# Altium project Thunderscope_Rev5.PrjPCB (part 1 of 2)
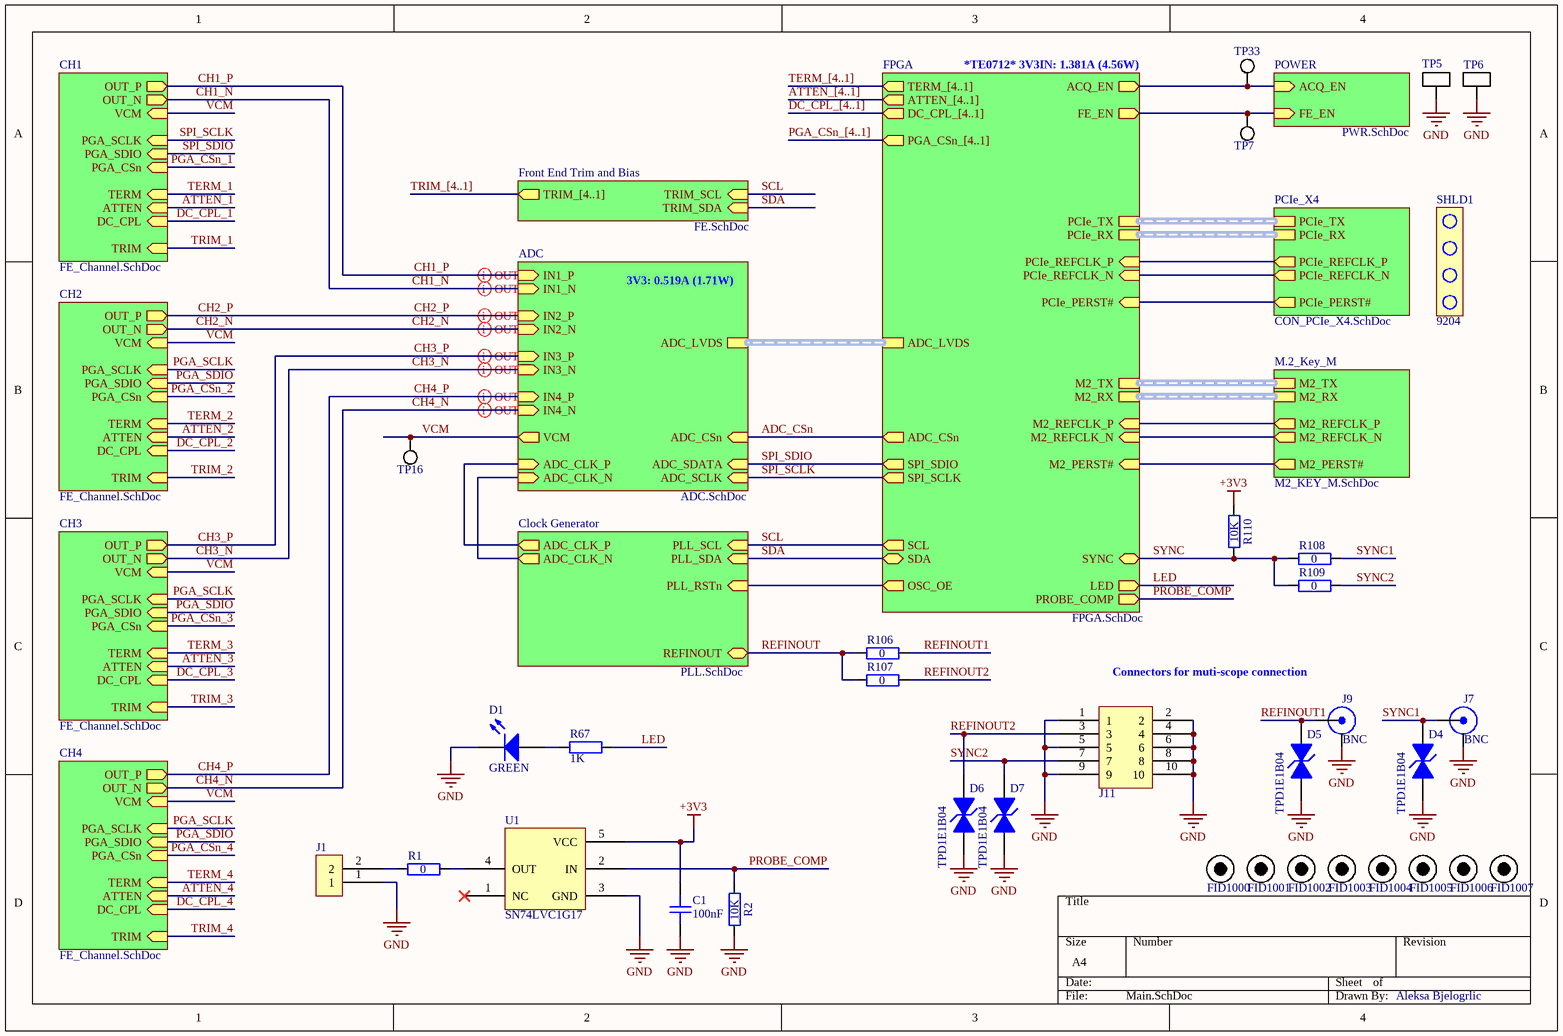
[diagram p0: Main.SchDoc]
Template Notes: - Nominal values used, dimensions in mm  - The mounting holes and keep-out areas around them are only required when the I/O bracket is mounted on the card directly  - Component height rule and clearance rule derived from PCI_Express_CEM_r2.0.pdf, Page 84.  - Stackup is not specified in PCI_Express_CEM_r2.0.pdf, nor implemented in this template.; Template Revision Date: Oct 29, 2010; Template Source Document: Outline:PCI_Express_CEM_r2.0.pdf  Pinout:PCI_Express_CEM_r2.0.pdf; Template Source Organization: PCI-SIG; Template Source Revision Date: R2.0, April 11, 2007; Template Source URL: http://www.pcisig.com; Title: ThunderScope 1000E
14 sheets, 733 parts. Net scope: hierarchical (ports join the sheet entries above them; power ports are global).
Board file: Thunderscope_Rev5.PCBDOC
Sheets:
  Main.SchDoc
    Front End Trim and Bias = FE.SchDoc
    FPGA = FPGA.SchDoc
      FPGA IO Banks = FPGA_Bank_IO.SchDoc
      FPGA Transceivers = FPGA_MGT.SchDoc
      FPGA Configuration = FPGA_CFG.SchDoc
      FPGA Power = FPGA_PWR.SchDoc
      Voltage Regulation = FPGA_REG.SchDoc
    M.2_Key_M = M2_KEY_M.SchDoc
    PCIe_X4 = CON_PCIe_X4.SchDoc
    POWER = PWR.SchDoc
    CH1 = FE_Channel.SchDoc
    ADC = ADC.SchDoc
    Clock Generator = PLL.SchDoc
    CH2 = FE_Channel.SchDoc
    CH3 = FE_Channel.SchDoc
    CH4 = FE_Channel.SchDoc

## Sheet Main.SchDoc: ThunderScope 1000E
size A4; DrawnBy: Aleksa Bjelogrlic; Revision: 1; SheetNumber: 1; SheetTotal: 14

### Parts
C1  100nF  [GEN_C_0402]
D1  GREEN  [LED_0603_LTST-S270K]
D4  TPD1E1B04  [TI_X1SON_DPY0002A]
D5  TPD1E1B04  [TI_X1SON_DPY0002A]
D6  TPD1E1B04  [TI_X1SON_DPY0002A]
D7  TPD1E1B04  [TI_X1SON_DPY0002A]
FID1000  PCB  [GEN_FID]  (value not drawn)  (no BOM)
FID1001  PCB  [GEN_FID]  (value not drawn)  (no BOM)
FID1002  PCB  [GEN_FID]  (value not drawn)  (no BOM)
FID1003  PCB  [GEN_FID]  (value not drawn)  (no BOM)
FID1004  PCB  [GEN_FID]  (value not drawn)  (no BOM)
FID1005  PCB  [GEN_FID]  (value not drawn)  (no BOM)
FID1006  PCB  [GEN_FID]  (value not drawn)  (no BOM)
FID1007  PCB  [GEN_FID]  (value not drawn)  (no BOM)
J1  TSW-101-08-F-D-RA  [GEN_2.54mm_1x2_Pin_TH_RA]  (value not drawn)
J7  BNC  [MOL_0731000105]
J9  BNC  [MOL_0731000105]
J11  1.27mm 6 Pin TH  [GEN_1.27mm_2x5_Pin_TH_RA]  (value not drawn)
R1  0  [GEN_R_0402]
R2  10K  [GEN_R_0402]
R67  1K  [GEN_R_0402]
R106  0  [GEN_R_0402]
R107  0  [GEN_R_0402]
R108  0  [GEN_R_0402]
R109  0  [GEN_R_0402]
R110  10K  [GEN_R_0402]
SHLD1  9204  (mechanical)
TP5  5019  [KEY_5019]  (value not drawn)
TP6  5019  [KEY_5019]  (value not drawn)
TP7  PCB  [GEN_TP_PCB]  (value not drawn)  (no BOM)
TP16  PCB  [GEN_TP_PCB]  (value not drawn)  (no BOM)
TP33  PCB  [GEN_TP_PCB]  (value not drawn)  (no BOM)
U1  SN74LVC1G17  [GEN_SC-70-5]

### Sub-sheets
ADC = ADC.SchDoc: IN4_N (in), IN4_P (in), IN3_N (in), IN3_P (in), IN2_N (in), IN2_P (in), VCM (out), IN1_N (in), IN1_P (in), ADC_CSn (in), ADC_SDATA (in), ADC_SCLK (in), ADC_CLK_P (in), ADC_CLK_N (in), ADC_LVDS (harness ADC LVDS)
CH1 = FE_Channel.SchDoc: OUT_P (out), VCM (in), OUT_N (out), TRIM (in), ATTEN (in), DC_CPL (in), PGA_CSn (in), PGA_SCLK (in), PGA_SDIO (in), TERM (in)
CH2 = FE_Channel.SchDoc: OUT_P (out), VCM (in), OUT_N (out), TRIM (in), ATTEN (in), DC_CPL (in), PGA_CSn (in), PGA_SCLK (in), PGA_SDIO (in), TERM (in)
CH3 = FE_Channel.SchDoc: OUT_P (out), VCM (in), OUT_N (out), TRIM (in), ATTEN (in), DC_CPL (in), PGA_CSn (in), PGA_SCLK (in), PGA_SDIO (in), TERM (in)
CH4 = FE_Channel.SchDoc: OUT_P (out), VCM (in), OUT_N (out), TRIM (in), ATTEN (in), DC_CPL (in), PGA_CSn (in), PGA_SCLK (in), PGA_SDIO (in), TERM (in)
Clock Generator = PLL.SchDoc: ADC_CLK_P (out), ADC_CLK_N (out), PLL_RSTn (in), PLL_SDA (in), PLL_SCL (in), REFINOUT (bidir)
FPGA = FPGA.SchDoc: ACQ_EN (out), OSC_OE (out), ADC_CSn (out), SCL (out), SDA (bidir), FE_EN (out), ATTEN_[4..1] (out), DC_CPL_[4..1] (out), SPI_SCLK (out), SPI_SDIO (out), PGA_CSn_[4..1] (out), PCIe_REFCLK_N (in), PCIe_PERST# (in), PCIe_REFCLK_P (in), PCIe_TX (harness PCIe_X4_TX), PCIe_RX (harness PCIe_X4_RX), M2_REFCLK_N (in), M2_PERST# (in), M2_REFCLK_P (in), M2_TX (harness M2_X4_TX), M2_RX (harness M2_X4_RX), TERM_[4..1] (out), SYNC (bidir), ADC_LVDS (harness ADC LVDS), PROBE_COMP (out), LED (out)
Front End Trim and Bias = FE.SchDoc: TRIM_SCL (in), TRIM_SDA (in), TRIM_[4..1] (out)
M.2_Key_M = M2_KEY_M.SchDoc: M2_REFCLK_N (out), M2_PERST# (out), M2_REFCLK_P (out), M2_TX (harness M2_X4_TX), M2_RX (harness M2_X4_RX)
PCIe_X4 = CON_PCIe_X4.SchDoc: PCIe_REFCLK_N (out), PCIe_PERST# (out), PCIe_REFCLK_P (out), PCIe_TX (harness PCIe_X4_TX), PCIe_RX (harness PCIe_X4_RX)
POWER = PWR.SchDoc: FE_EN (in), ACQ_EN (in)

### Nets
+3V3: C1.1 R110.1 U1.5(VCC)
GND: C1.2 D1.1(K) D4.2(A) D5.2(A) D6.2(A) D7.2(A) J1.1 J7.2(SHIELD) J9.2(SHIELD) J11.1 J11.2 J11.4 J11.5 J11.6 J11.8 J11.9 J11.10 R2.1 TP5.1 TP6.1 U1.3(GND)
ACQ_EN: TP33.1 ; sheet FPGA/ACQ_EN, sheet POWER/ACQ_EN
ADC_CLK_N: sheet ADC/ADC_CLK_N, sheet Clock Generator/ADC_CLK_N
ADC_CLK_P: sheet ADC/ADC_CLK_P, sheet Clock Generator/ADC_CLK_P
ADC_CSn: sheet FPGA/ADC_CSn, sheet ADC/ADC_CSn
CH1_N: sheet CH1/OUT_N, sheet ADC/IN1_N
CH1_P: sheet CH1/OUT_P, sheet ADC/IN1_P
CH2_N: sheet ADC/IN2_N, sheet CH2/OUT_N
CH2_P: sheet ADC/IN2_P, sheet CH2/OUT_P
CH3_N: sheet ADC/IN3_N, sheet CH3/OUT_N
CH3_P: sheet ADC/IN3_P, sheet CH3/OUT_P
CH4_N: sheet ADC/IN4_N, sheet CH4/OUT_N
CH4_P: sheet ADC/IN4_P, sheet CH4/OUT_P
FE_EN: TP7.1 ; sheet FPGA/FE_EN, sheet POWER/FE_EN
LED: R67.2 ; sheet FPGA/LED
M2_PERST#: sheet FPGA/M2_PERST#, sheet M.2_Key_M/M2_PERST#
M2_REFCLK_N: sheet FPGA/M2_REFCLK_N, sheet M.2_Key_M/M2_REFCLK_N
M2_REFCLK_P: sheet FPGA/M2_REFCLK_P, sheet M.2_Key_M/M2_REFCLK_P
OSC_OE: sheet FPGA/OSC_OE, sheet Clock Generator/PLL_RSTn
PCIe_PERST#: sheet FPGA/PCIe_PERST#, sheet PCIe_X4/PCIe_PERST#
PCIe_REFCLK_N: sheet FPGA/PCIe_REFCLK_N, sheet PCIe_X4/PCIe_REFCLK_N
PCIe_REFCLK_P: sheet FPGA/PCIe_REFCLK_P, sheet PCIe_X4/PCIe_REFCLK_P
PGA_SCLK: sheet CH2/PGA_SCLK, sheet CH3/PGA_SCLK, sheet CH4/PGA_SCLK
PGA_SDIO: sheet CH2/PGA_SDIO, sheet CH3/PGA_SDIO, sheet CH4/PGA_SDIO
PROBE_COMP: R2.2 U1.2(IN) ; sheet FPGA/PROBE_COMP
REFINOUT: R106.2 R107.2 ; sheet Clock Generator/REFINOUT
REFINOUT1: D5.1(K) J9.1(Signal) R106.1
REFINOUT2: D6.1(K) J11.3 R107.1
SCL: sheet Front End Trim and Bias/TRIM_SCL, sheet FPGA/SCL, sheet Clock Generator/PLL_SCL
SDA: sheet Front End Trim and Bias/TRIM_SDA, sheet FPGA/SDA, sheet Clock Generator/PLL_SDA
SPI_SCLK: sheet FPGA/SPI_SCLK, sheet CH1/PGA_SCLK, sheet ADC/ADC_SCLK  [project net ADC_SCLK]
SPI_SDIO: sheet FPGA/SPI_SDIO, sheet CH1/PGA_SDIO, sheet ADC/ADC_SDATA  [project net ADC_SDATA]
SYNC: R108.2 R109.2 R110.2 ; sheet FPGA/SYNC
SYNC1: D4.1(K) J7.1(Signal) R108.1
SYNC2: D7.1(K) J11.7 R109.1
VCM: TP16.1 ; sheet CH1/VCM, sheet ADC/VCM, sheet CH2/VCM, sheet CH3/VCM, sheet CH4/VCM
NetD1_2: D1.2(A) R67.1
NetJ1_2: J1.2 R1.1
NetR1_2: R1.2 U1.4(OUT)

Not connected (* = marked no-connect by the designer): U1 1(NC)*

### Buses and harness runs
bus ATTEN_[4..1] = sheet FPGA/ATTEN_[4..1]
bus DC_CPL_[4..1] = sheet FPGA/DC_CPL_[4..1]
bus PGA_CSn_[4..1] = sheet FPGA/PGA_CSn_[4..1]
bus TERM_[4..1] = sheet FPGA/TERM_[4..1]
bus TRIM_[4..1] = sheet Front End Trim and Bias/TRIM_[4..1]
harness sheet ADC/ADC_LVDS = sheet FPGA/ADC_LVDS
harness sheet FPGA/M2_RX = sheet M.2_Key_M/M2_RX
harness sheet FPGA/M2_TX = sheet M.2_Key_M/M2_TX
harness sheet FPGA/PCIe_RX = sheet PCIe_X4/PCIe_RX
harness sheet FPGA/PCIe_TX = sheet PCIe_X4/PCIe_TX

### Layout directives
differential pair; differential pair class 100Z_Diff_PGA: CH1_N, CH1_P, CH2_N, CH2_P, CH3_N, CH3_P, CH4_N, CH4_P

### Notes on the sheet
- *TE0712* 3V3IN: 1.381A (4.56W)
- 3V3: 0.519A (1.71W)
- Connectors for muti-scope connection
- Aleksa Bjelogrlic

### Library data of the parts
C1 = CAP 100nF 16V X7R 0402: House Part Number: C-100nF-0402-002; Manufacturer: Murata; Manufacturer Part Number: GCM155R71C104KA55D; Voltage Rating: 16V; Package: 0402; Supplier 1: Mouser; Supplier Part Number 1: 81-GCM155R71C104KA5D; Value: 100nF
D1 = LED GREEN 0603 LTST-S270K: Manufacturer: Vishay Lite-On; Manufacturer Part Number: LTST-S270KGKT; Supplier 1: Mouser; Supplier Part Number 1: 859-LTST-S270KGKT
D4-D7 = TVS TPD1E1B04: Manufacturer: Texas Instruments; Manufacturer Part Number: TPD1E1B04DPYR; Supplier 1: Texas Instruments; Supplier Part Number 1: TPD1E1B04DPYR
FID1000-FID1007 = FID 1mm: House Part Number: Fiducial-1
J1 = CONN 2.54mm 2 Pin TH RA: Manufacturer: Samtec; Supplier 1: Mouser; Supplier Part Number 1: 200-TSW10108FDRA; Manufacturer Part Number: TSW-101-08-F-D-RA
J7 J9 = BNC JACK R/A: Manufacturer: Molex; Manufacturer Part Number: 73100-0105; Supplier 1: Mouser; Supplier Part Number 1: 538-73100-0105
J11 = CONN 1.27mm 2x5 Pin TH RA: Manufacturer: CNC Tech; Manufacturer Part Number: 3220-10-0200-00; Supplier 1: Digi-Key; Supplier Part Number 1: 1175-1628-ND
R1 R106-R109 = RES 0 OHM 1/16W 0402: Manufacturer: Yageo; Manufacturer Part Number: RC0402JR-070RL; Package: 0402; Supplier 1: Mouser; Supplier Part Number 1: 603-RC0402JR-070RL; Value: 0
R2 R110 = RES 10K OHM 1% 1/10W 0402: Manufacturer: Panasonic; Manufacturer Part Number: ERJ-2RKF1002X; Tolerance: 1%; Package: 0402; Supplier 1: Mouser; Supplier Part Number 1: 667-ERJ-2RKF1002X; Value: 10K
R67 = RES 1K OHM 1% 1/10W 0402: House Part Number: R-1K-0402-1%-001; Manufacturer: Yageo; Manufacturer Part Number: RC0402FR-071KL; Tolerance: 1%; Package: 0402; Supplier 1: Mouser; Supplier Part Number 1: 603-RC0402FR-071KL; Value: 1K
SHLD1 = PCIe IO Shield: Manufacturer: Keystone Electronics; Supplier 1: Mouser; Supplier Part Number 1: 534-9204; Manufacturer Part Number: 9204
TP5 TP6 = TP KEYSTONE 5019: Manufacturer: Keystone Electronics; Supplier 1: Mouser; Supplier Part Number 1: 534-5019; Manufacturer Part Number: 5019
TP7 TP16 TP33 = TP PCB 1mm
U1 = IC BUFFER SN74LVC1G17: Manufacturer: Texas Instruments; Manufacturer Part Number: SN74LVC1G17DBVR; Supplier 1: Texas Instruments; Supplier Part Number 1: SN74LVC1G17DBVR

## Sheet FE.SchDoc: ThunderScope 1000E
size A4; Revision: 1; SheetNumber: 3; SheetTotal: 14
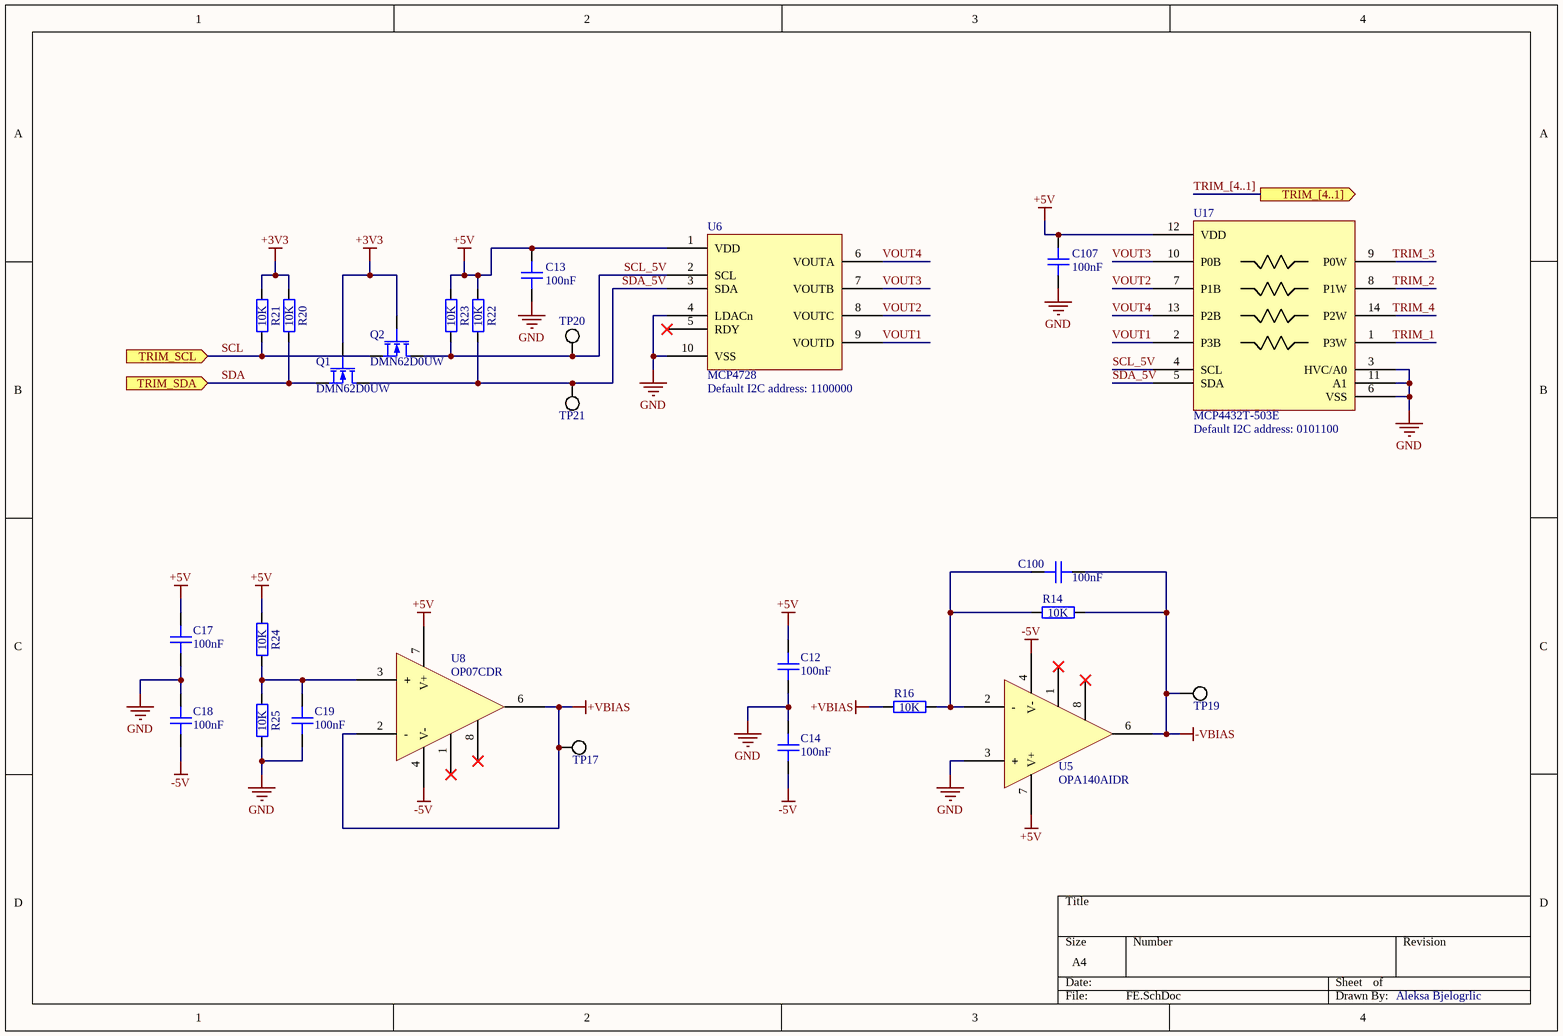
[diagram p1: FE.SchDoc]

### Parts
C12  100nF  [GEN_C_0402]
C13  100nF  [GEN_C_0402]
C14  100nF  [GEN_C_0402]
C17  100nF  [GEN_C_0402]
C18  100nF  [GEN_C_0402]
C19  100nF  [GEN_C_0402]
C100  100nF  [GEN_C_0402]
C107  100nF  [GEN_C_0402]
Q1  DMN62D0UW  [GEN_SOT_323]
Q2  DMN62D0UW  [GEN_SOT_323]
R14  10K  [GEN_R_0402]
R16  10K  [GEN_R_0402]
R20  10K  [GEN_R_0402]
R21  10K  [GEN_R_0402]
R22  10K  [GEN_R_0402]
R23  10K  [GEN_R_0402]
R24  10K  [GEN_R_0402]
R25  10K  [GEN_R_0402]
TP17  PCB  [GEN_TP_PCB]  (value not drawn)  (no BOM)
TP19  PCB  [GEN_TP_PCB]  (value not drawn)  (no BOM)
TP20  PCB  [GEN_TP_PCB]  (value not drawn)  (no BOM)
TP21  PCB  [GEN_TP_PCB]  (value not drawn)  (no BOM)
U5  OPA140AIDR  [TI_SOIC8_D0008A]
U6  MCP4728  [MC_MSOP10_UN]
U8  OP07CDR  [TI_SOIC8_D0008A]
U17  MCP4432T-503E  [MC_TSSOP14]

### Ports
TRIM_[4..1] (out), TRIM_SCL (in), TRIM_SDA (in)

### Nets
+3V3: Q1.2(G) Q2.2(G) R20.2 R21.2
+5V: C12.1 C13.2 C17.1 C107.2 R22.2 R23.2 R24.2 U5.7(V+) U6.1(VDD) U8.7(V+) U17.12(VDD)
+VBIAS: R16.1 TP17.1 U8.2(-) U8.6(OUT)
-5V: C14.2 C18.2 U5.4(V-) U8.4(V-)
-VBIAS: C100.1 R14.2 TP19.1 U5.6(OUT)
GND: C12.2 C13.1 C14.1 C17.2 C18.1 C19.1 C107.1 R25.1 U5.3(+) U6.4(LDACn) U6.10(VSS) U17.3(HVC/A0) U17.6(VSS) U17.11(A1)
SCL: Q2.3(S) R21.1 ; port TRIM_SCL
SCL_5V: Q2.1(D) R23.1 TP20.1 U6.2(SCL) U17.4(SCL)
SDA: Q1.3(S) R20.1 ; port TRIM_SDA
SDA_5V: Q1.1(D) R22.1 TP21.1 U6.3(SDA) U17.5(SDA)
TRIM_1: U17.1(P3W)
TRIM_2: U17.8(P1W)
TRIM_3: U17.9(P0W)
TRIM_4: U17.14(P2W)
VOUT1: U6.9(VOUTD) U17.2(P3B)
VOUT2: U6.8(VOUTC) U17.7(P1B)
VOUT3: U6.7(VOUTB) U17.10(P0B)
VOUT4: U6.6(VOUTA) U17.13(P2B)
NetC19_2: C19.2 R24.1 R25.2 U8.3(+)
NetC100_2: C100.2 R14.1 R16.2 U5.2(-)

Not connected (* = marked no-connect by the designer): U5 1(N1)* 8(N2)*; U6 5(RDY)*; U8 1(N1)* 8(N2)*

### Buses and harness runs
bus TRIM_[4..1] = port TRIM_[4..1]

### Notes on the sheet
- (near U6) Default I2C address: 1100000
- (near U17) Default I2C address: 0101100
- Aleksa Bjelogrlic

### Library data of the parts
C12-C14 C17-C19 C100 C107 = CAP 100nF 16V X7R 0402: as C1 on sheet Main; Package: 0402; Supplier 1: Mouser; Supplier Part Number 1: 81-GCM155R71C104KA5D; Value: 100nF
Q1 Q2 = NMOS DMN62D0UW: House Part Number: DMN62D0UW-7; Manufacturer: Diodes; Vdss: 60V; Supplier 1: Mouser; Supplier Part Number 1: 621-DMN62D0UW-7; Manufacturer Part Number: DMN62D0UW-7
R14 R16 R20-R25 = RES 10K OHM 1% 1/10W 0402: as R2 on sheet Main; Package: 0402; Supplier 1: Mouser; Supplier Part Number 1: 667-ERJ-2RKF1002X; Value: 10K
TP17 TP19-TP21 = TP PCB 1mm
U5 = IC OPAMP OPA140: Manufacturer: Texas Instruments; Supplier 1: Texas Instruments; Supplier Part Number 1: OPA140AIDR; Manufacturer Part Number: OPA140AIDR
U6 = IC DAC QUAD MCP4728: Manufacturer: Microchip; Supplier 1: Mouser; Supplier Part Number 1: 579-MCP4728A1T-E/UN; Manufacturer Part Number: MCP4728
U8 = IC OPAMP OP07CDR: Manufacturer: Texas Instruments; Supplier 1: Texas Instruments; Supplier Part Number 1: OP07CDR; Manufacturer Part Number: OP07CDR
U17 = IC DIGIPOT QUAD MCP4432T-503E: Manufacturer: Microchip; Manufacturer Part Number: MCP4432T-503E/ST; Supplier 1: Mouser; Supplier Part Number 1: 579-MCP4432-503E/ST

## Sheet FPGA.SchDoc: ThunderScope 1000E
size A4; SheetNumber: 7; SheetTotal: 14
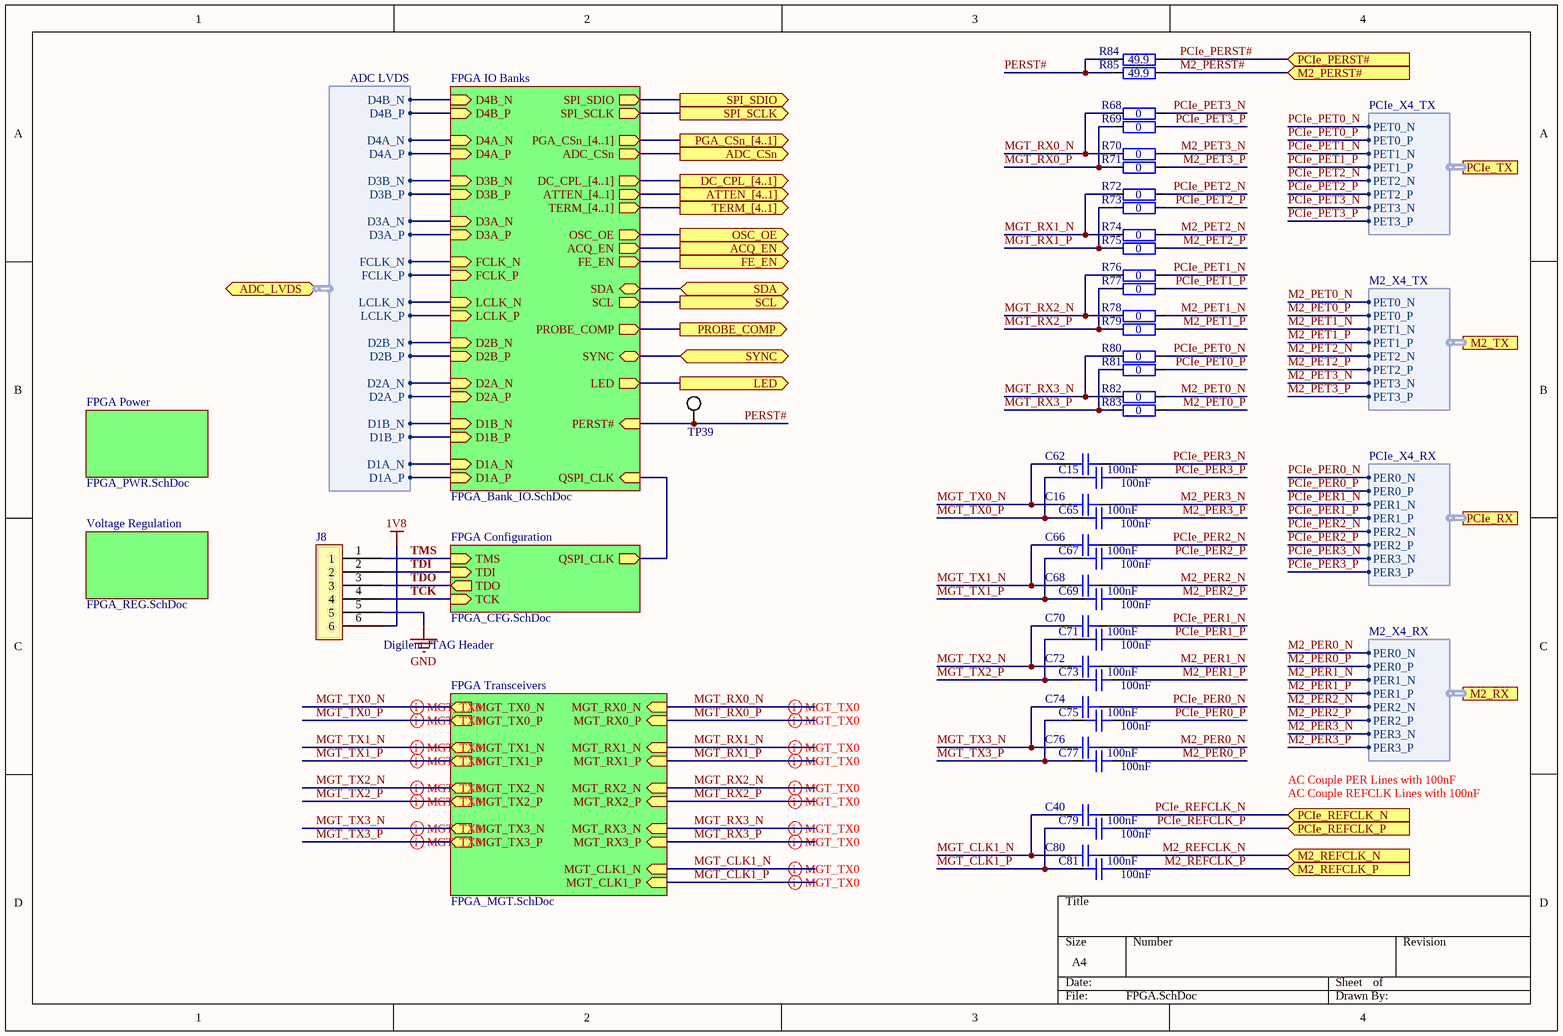
[diagram p2: FPGA.SchDoc]

### Parts
C15  100nF  [GEN_C_0201]
C16  100nF  [GEN_C_0201]
C40  100nF  [GEN_C_0201]
C62  100nF  [GEN_C_0201]
C65  100nF  [GEN_C_0201]
C66  100nF  [GEN_C_0201]
C67  100nF  [GEN_C_0201]
C68  100nF  [GEN_C_0201]
C69  100nF  [GEN_C_0201]
C70  100nF  [GEN_C_0201]
C71  100nF  [GEN_C_0201]
C72  100nF  [GEN_C_0201]
C73  100nF  [GEN_C_0201]
C74  100nF  [GEN_C_0201]
C75  100nF  [GEN_C_0201]
C76  100nF  [GEN_C_0201]
C77  100nF  [GEN_C_0201]
C79  100nF  [GEN_C_0201]
C80  100nF  [GEN_C_0201]
C81  100nF  [GEN_C_0201]
J8  2.54mm 6 Pin TH  [GEN_2.54mm_6_Pin_TH_RA]  (value not drawn)
R68  0  [GEN_R_0201]
R69  0  [GEN_R_0201]
R70  0  [GEN_R_0201]
R71  0  [GEN_R_0201]
R72  0  [GEN_R_0201]
R73  0  [GEN_R_0201]
R74  0  [GEN_R_0201]
R75  0  [GEN_R_0201]
R76  0  [GEN_R_0201]
R77  0  [GEN_R_0201]
R78  0  [GEN_R_0201]
R79  0  [GEN_R_0201]
R80  0  [GEN_R_0201]
R81  0  [GEN_R_0201]
R82  0  [GEN_R_0201]
R83  0  [GEN_R_0201]
R84  49.9  [GEN_R_0402]
R85  49.9  [GEN_R_0402]
TP39  PCB  [GEN_TP_PCB]  (value not drawn)  (no BOM)

### Sub-sheets
FPGA Configuration = FPGA_CFG.SchDoc: TDI (in), TDO (out), TCK (in), TMS (in), QSPI_CLK (out)
FPGA IO Banks = FPGA_Bank_IO.SchDoc: LCLK_P (in), LCLK_N (in), FCLK_P (in), FCLK_N (in), D1B_P (in), D1B_N (in), D3B_N (in), D3B_P (in), D1A_P (in), D1A_N (in), D4A_N (in), D4A_P (in), D3A_P (in), D3A_N (in), D4B_N (in), D4B_P (in), D2A_N (in), D2A_P (in), D2B_N (in), D2B_P (in), SPI_SDIO (out), SYNC (bidir), SPI_SCLK (out), PROBE_COMP (out), OSC_OE (out), ACQ_EN (out), FE_EN (out), SDA (bidir), SCL (out), ADC_CSn (out), PERST# (in), DC_CPL_[4..1] (out), ATTEN_[4..1] (out), PGA_CSn_[4..1] (out), TERM_[4..1] (out), LED (out), QSPI_CLK (in)
FPGA Power = FPGA_PWR.SchDoc: no entries
FPGA Transceivers = FPGA_MGT.SchDoc: MGT_TX3_N (out), MGT_TX2_N (out), MGT_TX1_N (out), MGT_TX0_N (out), MGT_TX3_P (out), MGT_TX2_P (out), MGT_TX1_P (out), MGT_TX0_P (out), MGT_RX3_N (in), MGT_RX3_P (in), MGT_RX2_N (in), MGT_RX2_P (in), MGT_RX1_N (in), MGT_RX1_P (in), MGT_RX0_N (in), MGT_RX0_P (in), MGT_CLK1_N (in), MGT_CLK1_P (in)
Voltage Regulation = FPGA_REG.SchDoc: no entries

### Ports
ACQ_EN (out), ADC_CSn (out), ADC_LVDS (bidir, harness ADC LVDS), ATTEN_[4..1] (out), DC_CPL_[4..1] (out), FE_EN (out), LED (out), M2_PERST# (in), M2_REFCLK_N (in), M2_REFCLK_P (in), M2_RX (harness M2_X4_RX), M2_TX (harness M2_X4_TX), OSC_OE (out), PCIe_PERST# (in), PCIe_REFCLK_N (in), PCIe_REFCLK_P (in), PCIe_RX (harness PCIe_X4_RX), PCIe_TX (harness PCIe_X4_TX), PGA_CSn_[4..1] (out), PROBE_COMP (out), SCL (out), SDA (bidir), SPI_SCLK (out), SPI_SDIO (out), SYNC (bidir), TERM_[4..1] (out)

### Harnesses
PCIe_X4_RX: PER0_N, PER0_P, PER1_N, PER1_P, PER2_N, PER2_P, PER3_N, PER3_P
PCIe_X4_TX: PET0_N, PET0_P, PET1_N, PET1_P, PET2_N, PET2_P, PET3_N, PET3_P
M2_X4_RX: PER0_N, PER0_P, PER1_N, PER1_P, PER2_N, PER2_P, PER3_N, PER3_P
M2_X4_TX: PET0_N, PET0_P, PET1_N, PET1_P, PET2_N, PET2_P, PET3_N, PET3_P
ADC LVDS: D4B_N, D4B_P, D4A_N, D4A_P, D3B_N, D3B_P, D3A_N, D3A_P, FCLK_N, FCLK_P, LCLK_N, LCLK_P, D2B_N, D2B_P, D2A_N, D2A_P, D1B_N, D1B_P, D1A_N, D1A_P

### Nets
1V8: J8.6
GND: J8.5
ACQ_EN: port ACQ_EN, sheet FPGA IO Banks/ACQ_EN
ADC_CSn: port ADC_CSn, sheet FPGA IO Banks/ADC_CSn
ADC_SCLK: port SPI_SCLK, sheet FPGA IO Banks/SPI_SCLK
ADC_SDATA: port SPI_SDIO, sheet FPGA IO Banks/SPI_SDIO
D1A_N: sheet FPGA IO Banks/D1A_N, port ADC_LVDS.D1A_N
D1A_P: sheet FPGA IO Banks/D1A_P, port ADC_LVDS.D1A_P
D1B_N: sheet FPGA IO Banks/D1B_N, port ADC_LVDS.D1B_N
D1B_P: sheet FPGA IO Banks/D1B_P, port ADC_LVDS.D1B_P
D2A_N: sheet FPGA IO Banks/D2A_N, port ADC_LVDS.D2A_N
D2A_P: sheet FPGA IO Banks/D2A_P, port ADC_LVDS.D2A_P
D2B_N: sheet FPGA IO Banks/D2B_N, port ADC_LVDS.D2B_N
D2B_P: sheet FPGA IO Banks/D2B_P, port ADC_LVDS.D2B_P
D3A_N: sheet FPGA IO Banks/D3A_N, port ADC_LVDS.D3A_N
D3A_P: sheet FPGA IO Banks/D3A_P, port ADC_LVDS.D3A_P
D3B_N: sheet FPGA IO Banks/D3B_N, port ADC_LVDS.D3B_N
D3B_P: sheet FPGA IO Banks/D3B_P, port ADC_LVDS.D3B_P
D4A_N: sheet FPGA IO Banks/D4A_N, port ADC_LVDS.D4A_N
D4A_P: sheet FPGA IO Banks/D4A_P, port ADC_LVDS.D4A_P
D4B_N: sheet FPGA IO Banks/D4B_N, port ADC_LVDS.D4B_N
D4B_P: sheet FPGA IO Banks/D4B_P, port ADC_LVDS.D4B_P
FCLK_N: sheet FPGA IO Banks/FCLK_N, port ADC_LVDS.FCLK_N
FCLK_P: sheet FPGA IO Banks/FCLK_P, port ADC_LVDS.FCLK_P
FE_EN: port FE_EN, sheet FPGA IO Banks/FE_EN
LCLK_N: sheet FPGA IO Banks/LCLK_N, port ADC_LVDS.LCLK_N
LCLK_P: sheet FPGA IO Banks/LCLK_P, port ADC_LVDS.LCLK_P
LED: port LED, sheet FPGA IO Banks/LED
M2_PER0_N: C76.1 ; port M2_RX.PER0_N
M2_PER0_P: C77.1 ; port M2_RX.PER0_P
M2_PER1_N: C72.1 ; port M2_RX.PER1_N
M2_PER1_P: C73.1 ; port M2_RX.PER1_P
M2_PER2_N: C68.1 ; port M2_RX.PER2_N
M2_PER2_P: C69.1 ; port M2_RX.PER2_P
M2_PER3_N: C16.1 ; port M2_RX.PER3_N
M2_PER3_P: C65.1 ; port M2_RX.PER3_P
M2_PERST#: R85.2 ; port M2_PERST#
M2_PET0_N: R82.2 ; port M2_TX.PET0_N
M2_PET0_P: R83.2 ; port M2_TX.PET0_P
M2_PET1_N: R78.2 ; port M2_TX.PET1_N
M2_PET1_P: R79.2 ; port M2_TX.PET1_P
M2_PET2_N: R74.2 ; port M2_TX.PET2_N
M2_PET2_P: R75.2 ; port M2_TX.PET2_P
M2_PET3_N: R70.2 ; port M2_TX.PET3_N
M2_PET3_P: R71.2 ; port M2_TX.PET3_P
M2_REFCLK_N: C80.1 ; port M2_REFCLK_N
M2_REFCLK_P: C81.1 ; port M2_REFCLK_P
MGT_CLK1_N: C40.2 C80.2 ; sheet FPGA Transceivers/MGT_CLK1_N
MGT_CLK1_P: C79.2 C81.2 ; sheet FPGA Transceivers/MGT_CLK1_P
MGT_RX0_N: R68.1 R70.1 ; sheet FPGA Transceivers/MGT_RX0_N
MGT_RX0_P: R69.1 R71.1 ; sheet FPGA Transceivers/MGT_RX0_P
MGT_RX1_N: R72.1 R74.1 ; sheet FPGA Transceivers/MGT_RX1_N
MGT_RX1_P: R73.1 R75.1 ; sheet FPGA Transceivers/MGT_RX1_P
MGT_RX2_N: R76.1 R78.1 ; sheet FPGA Transceivers/MGT_RX2_N
MGT_RX2_P: R77.1 R79.1 ; sheet FPGA Transceivers/MGT_RX2_P
MGT_RX3_N: R80.1 R82.1 ; sheet FPGA Transceivers/MGT_RX3_N
MGT_RX3_P: R81.1 R83.1 ; sheet FPGA Transceivers/MGT_RX3_P
MGT_TX0_N: C16.2 C62.2 ; sheet FPGA Transceivers/MGT_TX0_N
MGT_TX0_P: C15.2 C65.2 ; sheet FPGA Transceivers/MGT_TX0_P
MGT_TX1_N: C66.2 C68.2 ; sheet FPGA Transceivers/MGT_TX1_N
MGT_TX1_P: C67.2 C69.2 ; sheet FPGA Transceivers/MGT_TX1_P
MGT_TX2_N: C70.2 C72.2 ; sheet FPGA Transceivers/MGT_TX2_N
MGT_TX2_P: C71.2 C73.2 ; sheet FPGA Transceivers/MGT_TX2_P
MGT_TX3_N: C74.2 C76.2 ; sheet FPGA Transceivers/MGT_TX3_N
MGT_TX3_P: C75.2 C77.2 ; sheet FPGA Transceivers/MGT_TX3_P
OSC_OE: port OSC_OE, sheet FPGA IO Banks/OSC_OE
PCIe_PER0_N: C74.1 ; port PCIe_RX.PER0_N
PCIe_PER0_P: C75.1 ; port PCIe_RX.PER0_P
PCIe_PER1_N: C70.1 ; port PCIe_RX.PER1_N
PCIe_PER1_P: C71.1 ; port PCIe_RX.PER1_P
PCIe_PER2_N: C66.1 ; port PCIe_RX.PER2_N
PCIe_PER2_P: C67.1 ; port PCIe_RX.PER2_P
PCIe_PER3_N: C62.1 ; port PCIe_RX.PER3_N
PCIe_PER3_P: C15.1 ; port PCIe_RX.PER3_P
PCIe_PERST#: R84.2 ; port PCIe_PERST#
PCIe_PET0_N: R80.2 ; port PCIe_TX.PET0_N
PCIe_PET0_P: R81.2 ; port PCIe_TX.PET0_P
PCIe_PET1_N: R76.2 ; port PCIe_TX.PET1_N
PCIe_PET1_P: R77.2 ; port PCIe_TX.PET1_P
PCIe_PET2_N: R72.2 ; port PCIe_TX.PET2_N
PCIe_PET2_P: R73.2 ; port PCIe_TX.PET2_P
PCIe_PET3_N: R68.2 ; port PCIe_TX.PET3_N
PCIe_PET3_P: R69.2 ; port PCIe_TX.PET3_P
PCIe_REFCLK_N: C40.1 ; port PCIe_REFCLK_N
PCIe_REFCLK_P: C79.1 ; port PCIe_REFCLK_P
PERST#: R84.1 R85.1 TP39.1 ; sheet FPGA IO Banks/PERST#
PROBE_COMP: port PROBE_COMP, sheet FPGA IO Banks/PROBE_COMP
QSPI_CLK: sheet FPGA IO Banks/QSPI_CLK, sheet FPGA Configuration/QSPI_CLK
SCL: port SCL, sheet FPGA IO Banks/SCL
SDA: port SDA, sheet FPGA IO Banks/SDA
SYNC: port SYNC, sheet FPGA IO Banks/SYNC
TCK: J8.4 ; sheet FPGA Configuration/TCK
TDI: J8.2 ; sheet FPGA Configuration/TDI
TDO: J8.3 ; sheet FPGA Configuration/TDO
TMS: J8.1 ; sheet FPGA Configuration/TMS

### Buses and harness runs
bus port ATTEN_[4..1] = sheet FPGA IO Banks/ATTEN_[4..1]
bus port DC_CPL_[4..1] = sheet FPGA IO Banks/DC_CPL_[4..1]
bus port PGA_CSn_[4..1] = sheet FPGA IO Banks/PGA_CSn_[4..1]
bus port TERM_[4..1] = sheet FPGA IO Banks/TERM_[4..1]

### Layout directives
differential pair; differential pair class PCIe: MGT_CLK1_N, MGT_CLK1_P, MGT_RX0_N, MGT_RX0_P, MGT_RX1_N, MGT_RX1_P, MGT_RX2_N, MGT_RX2_P, MGT_RX3_N, MGT_RX3_P, MGT_TX0_N, MGT_TX0_P, MGT_TX1_N, MGT_TX1_P, MGT_TX2_N, MGT_TX2_P, MGT_TX3_N, MGT_TX3_P

### Notes on the sheet
- (near J8) Digilent JTAG Header
- AC Couple PER Lines with 100nF
- AC Couple REFCLK Lines with 100nF

### Library data of the parts
C15 C16 C40 C62 C65-C77 C79-C81 = CAP 100nF 6.3V X5R 0201: House Part Number: C-100nF-0201-002; Manufacturer: Murata; Manufacturer Part Number: GRM033R60J104KE19D; Voltage Rating: 6.3V; Package: 0201; Supplier 1: Mouser; Supplier Part Number 1: 81-GRM033R60J104KE19; Value: 100nF
J8 = CONN 2.54mm 6 Pin TH RA: Manufacturer: Wurth Electronics; Manufacturer Part Number: 61300611021; Supplier 1: Mouser; Supplier Part Number 1: 710-61300611021
R68-R83 = RES 0 OHM 1% 1/20W 0201: Manufacturer: Stackpole Electronics; Manufacturer Part Number: RMCF0201ZT0R00; Tolerance: 1%; Package: 0201; Supplier 1: Mouser; Supplier Part Number 1: 708-RMCF0201ZT0R00; Value: 0
R84 R85 = RES 49.9 OHM 1% 1/10W 0402: Manufacturer: Yageo; Manufacturer Part Number: RC0402FR-0749R9L; Tolerance: 1%; Package: 0402; Supplier 1: Mouser; Supplier Part Number 1: 603-RC0402FR-0749R9L; Value: 49.9
TP39 = TP PCB 1mm

## Sheet FPGA_Bank_IO.SchDoc: ThunderScope 1000E
size A4; SheetNumber: 8; SheetTotal: 14
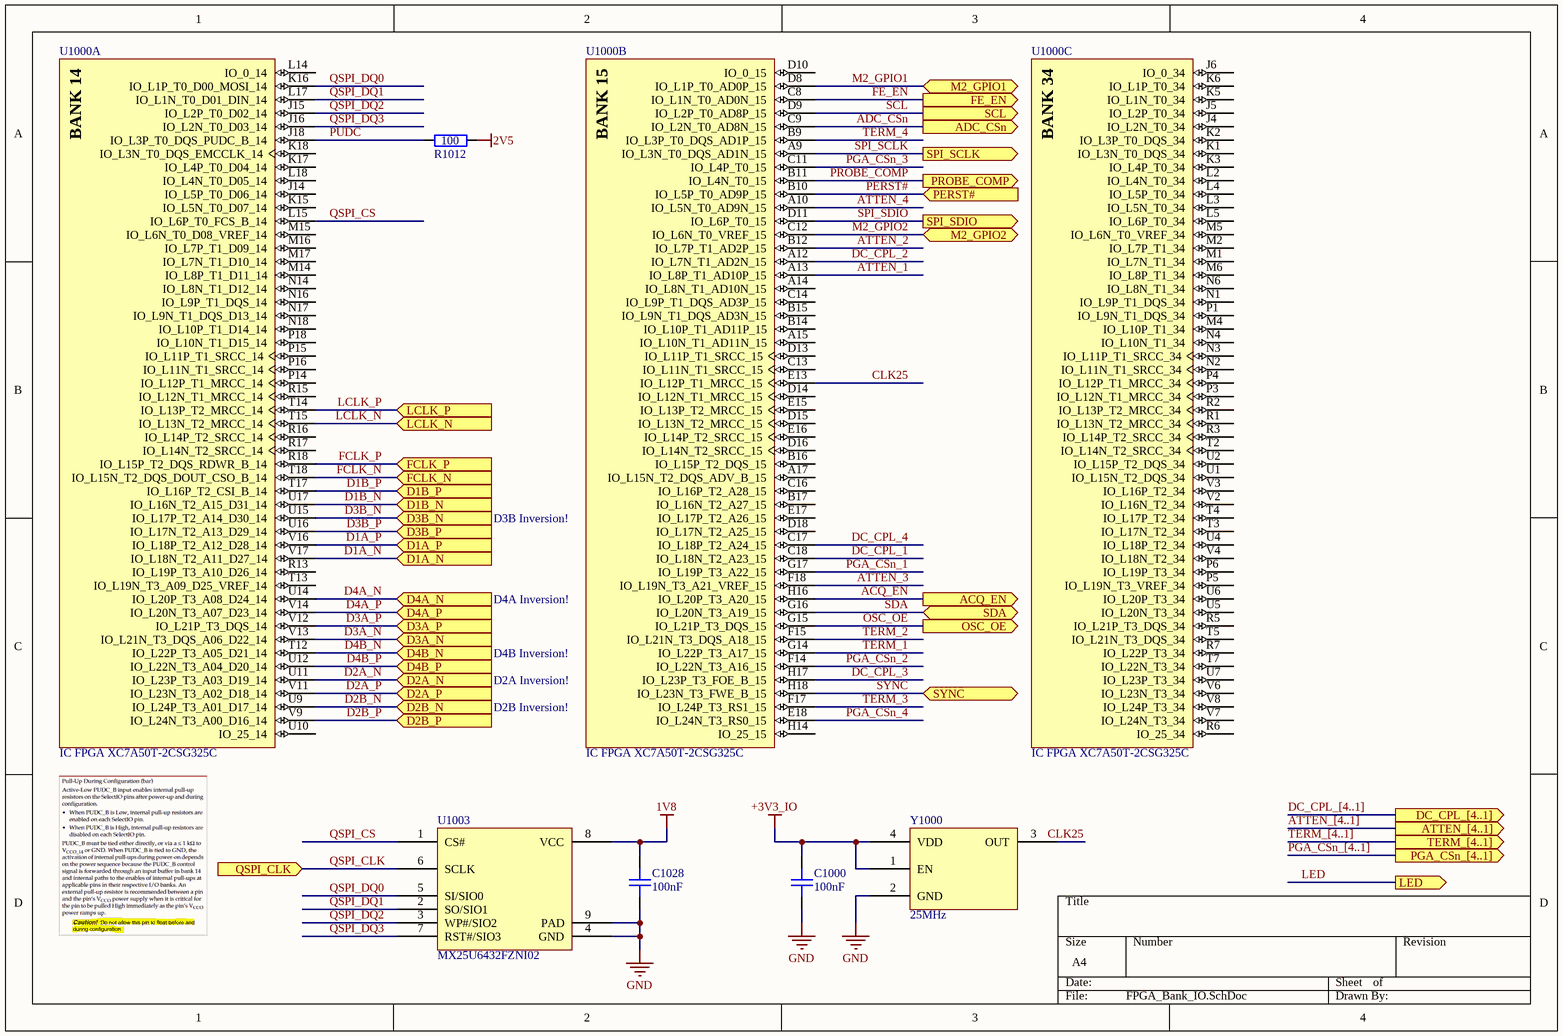
[diagram p3: FPGA_Bank_IO.SchDoc]

### Parts
C1000  100nF  [GEN_C_0402]
C1028  100nF  [GEN_C_0402]
R1012  100  [GEN_R_0402]
U1000  IC FPGA XC7A50T-2CSG325C  [XILINX_XC7A50T-2CSG325C]  (parts A,B,C of 9)
U1003  MX25U6432FZNI02  [MX_WSON8]
Y1000  25MHz  [ECS_TXO-2016]

### Ports
ACQ_EN (out), ADC_CSn (out), ATTEN_[4..1] (out), D1A_N (in), D1A_P (in), D1B_N (in), D1B_P (in), D2A_N (in), D2A_P (in), D2B_N (in), D2B_P (in), D3A_N (in), D3A_P (in), D3B_N (in), D3B_P (in), D4A_N (in), D4A_P (in), D4B_N (in), D4B_P (in), DC_CPL_[4..1] (out), FCLK_N (in), FCLK_P (in), FE_EN (out), LCLK_N (in), LCLK_P (in), LED (out), M2_GPIO1 (bidir), M2_GPIO2 (bidir), OSC_OE (out), PERST# (in), PGA_CSn_[4..1] (out), PROBE_COMP (out), QSPI_CLK (in), SCL (out), SDA (bidir), SPI_SCLK (out), SPI_SDIO (out), SYNC (bidir), TERM_[4..1] (out)

### Nets
1V8: C1028.1 U1003.8(VCC)
2V5: R1012.2
+3V3_IO: C1000.1 Y1000.1(EN) Y1000.4(VDD)
GND: C1000.2 C1028.2 U1003.4(GND) U1003.9(PAD) Y1000.2(GND)
ACQ_EN: U1000.H16(IO_L20P_T3_A20_15) ; port ACQ_EN
ADC_CSn: U1000.C9(IO_L2N_T0_AD8N_15) ; port ADC_CSn
ATTEN_1: U1000.A13(IO_L8P_T1_AD10P_15)
ATTEN_2: U1000.B12(IO_L7P_T1_AD2P_15)
ATTEN_3: U1000.F18(IO_L19N_T3_A21_VREF_15)
ATTEN_4: U1000.A10(IO_L5N_T0_AD9N_15)
CLK25: U1000.E13(IO_L12P_T1_MRCC_15) Y1000.3(OUT)
D1A_N: U1000.V17(IO_L18N_T2_A11_D27_14) ; port D1A_N
D1A_P: U1000.V16(IO_L18P_T2_A12_D28_14) ; port D1A_P
D1B_N: U1000.U17(IO_L16N_T2_A15_D31_14) ; port D1B_N
D1B_P: U1000.T17(IO_L16P_T2_CSI_B_14) ; port D1B_P
D2A_N: U1000.U11(IO_L23P_T3_A03_D19_14) ; port D2A_N
D2A_P: U1000.V11(IO_L23N_T3_A02_D18_14) ; port D2A_P
D2B_N: U1000.U9(IO_L24P_T3_A01_D17_14) ; port D2B_N
D2B_P: U1000.V9(IO_L24N_T3_A00_D16_14) ; port D2B_P
D3A_N: U1000.V13(IO_L21N_T3_DQS_A06_D22_14) ; port D3A_N
D3A_P: U1000.V12(IO_L21P_T3_DQS_14) ; port D3A_P
D3B_N: U1000.U15(IO_L17P_T2_A14_D30_14) ; port D3B_N
D3B_P: U1000.U16(IO_L17N_T2_A13_D29_14) ; port D3B_P
D4A_N: U1000.U14(IO_L20P_T3_A08_D24_14) ; port D4A_N
D4A_P: U1000.V14(IO_L20N_T3_A07_D23_14) ; port D4A_P
D4B_N: U1000.T12(IO_L22P_T3_A05_D21_14) ; port D4B_N
D4B_P: U1000.U12(IO_L22N_T3_A04_D20_14) ; port D4B_P
DC_CPL_1: U1000.C18(IO_L18N_T2_A23_15)
DC_CPL_2: U1000.A12(IO_L7N_T1_AD2N_15)
DC_CPL_3: U1000.H17(IO_L23P_T3_FOE_B_15)
DC_CPL_4: U1000.C17(IO_L18P_T2_A24_15)
FCLK_N: U1000.T18(IO_L15N_T2_DQS_DOUT_CSO_B_14) ; port FCLK_N
FCLK_P: U1000.R18(IO_L15P_T2_DQS_RDWR_B_14) ; port FCLK_P
FE_EN: U1000.C8(IO_L1N_T0_AD0N_15) ; port FE_EN
LCLK_N: U1000.T15(IO_L13N_T2_MRCC_14) ; port LCLK_N
LCLK_P: U1000.T14(IO_L13P_T2_MRCC_14) ; port LCLK_P
M2_GPIO1: U1000.D8(IO_L1P_T0_AD0P_15) ; port M2_GPIO1
M2_GPIO2: U1000.C12(IO_L6N_T0_VREF_15) ; port M2_GPIO2
OSC_OE: U1000.G15(IO_L21P_T3_DQS_15) ; port OSC_OE
PERST#: U1000.B10(IO_L5P_T0_AD9P_15) ; port PERST#
PGA_CSn_1: U1000.G17(IO_L19P_T3_A22_15)
PGA_CSn_2: U1000.F14(IO_L22N_T3_A16_15)
PGA_CSn_3: U1000.C11(IO_L4P_T0_15)
PGA_CSn_4: U1000.E18(IO_L24N_T3_RS0_15)
PROBE_COMP: U1000.B11(IO_L4N_T0_15) ; port PROBE_COMP
PUDC: R1012.1 U1000.J18(IO_L3P_T0_DQS_PUDC_B_14)
QSPI_CLK: U1003.6(SCLK) ; port QSPI_CLK
QSPI_CS: U1000.L15(IO_L6P_T0_FCS_B_14) U1003.1(CS#)
QSPI_DQ0: U1000.K16(IO_L1P_T0_D00_MOSI_14) U1003.5(SI/SIO0)
QSPI_DQ1: U1000.L17(IO_L1N_T0_D01_DIN_14) U1003.2(SO/SIO1)
QSPI_DQ2: U1000.J15(IO_L2P_T0_D02_14) U1003.3(WP#/SIO2)
QSPI_DQ3: U1000.J16(IO_L2N_T0_D03_14) U1003.7(RST#/SIO3)
SCL: U1000.D9(IO_L2P_T0_AD8P_15) ; port SCL
SDA: U1000.G16(IO_L20N_T3_A19_15) ; port SDA
SPI_SCLK: U1000.A9(IO_L3N_T0_DQS_AD1N_15) ; port SPI_SCLK  [project net ADC_SCLK]
SPI_SDIO: U1000.D11(IO_L6P_T0_15) ; port SPI_SDIO  [project net ADC_SDATA]
SYNC: U1000.H18(IO_L23N_T3_FWE_B_15) ; port SYNC
TERM_1: U1000.G14(IO_L22P_T3_A17_15)
TERM_2: U1000.F15(IO_L21N_T3_DQS_A18_15)
TERM_3: U1000.F17(IO_L24P_T3_RS1_15)
TERM_4: U1000.B9(IO_L3P_T0_DQS_AD1P_15)

Not connected (* = marked no-connect by the designer): U1000 A14(IO_L8N_T1_AD10N_15) A15(IO_L10N_T1_AD11N_15) A17(IO_L15N_T2_DQS_ADV_B_15) B14(IO_L10P_T1_AD11P_15) B15(IO_L9N_T1_DQS_AD3N_15) B16(IO_L15P_T2_DQS_15) B17(IO_L16N_T2_A27_15) C13(IO_L11N_T1_SRCC_15) C14(IO_L9P_T1_DQS_AD3P_15) C16(IO_L16P_T2_A28_15) D10(IO_0_15) D13(IO_L11P_T1_SRCC_15) D14(IO_L12N_T1_MRCC_15) D15(IO_L13N_T2_MRCC_15) D16(IO_L14N_T2_SRCC_15) D18(IO_L17N_T2_A25_15) E15(IO_L13P_T2_MRCC_15) E16(IO_L14P_T2_SRCC_15) E17(IO_L17P_T2_A26_15) H14(IO_25_15) J4(IO_L2N_T0_34) J5(IO_L2P_T0_34) J6(IO_0_34) J14(IO_L5P_T0_D06_14) K1(IO_L3N_T0_DQS_34) K2(IO_L3P_T0_DQS_34) K3(IO_L4P_T0_34) K5(IO_L1N_T0_34) K6(IO_L1P_T0_34) K15(IO_L5N_T0_D07_14) K17(IO_L4P_T0_D04_14) K18(IO_L3N_T0_DQS_EMCCLK_14) L2(IO_L4N_T0_34) L3(IO_L5N_T0_34) L4(IO_L5P_T0_34) L5(IO_L6P_T0_34) L14(IO_0_14) L18(IO_L4N_T0_D05_14) M1(IO_L7N_T1_34) M2(IO_L7P_T1_34) M4(IO_L10P_T1_34) M5(IO_L6N_T0_VREF_34) M6(IO_L8P_T1_34) M14(IO_L8P_T1_D11_14) M15(IO_L6N_T0_D08_VREF_14) M16(IO_L7P_T1_D09_14) M17(IO_L7N_T1_D10_14) N1(IO_L9P_T1_DQS_34) N2(IO_L11N_T1_SRCC_34) N3(IO_L11P_T1_SRCC_34) N4(IO_L10N_T1_34) N6(IO_L8N_T1_34) N14(IO_L8N_T1_D12_14) N16(IO_L9P_T1_DQS_14) N17(IO_L9N_T1_DQS_D13_14) N18(IO_L10P_T1_D14_14) P1(IO_L9N_T1_DQS_34) P3(IO_L12N_T1_MRCC_34) P4(IO_L12P_T1_MRCC_34) P5(IO_L19N_T3_VREF_34) P6(IO_L19P_T3_34) P14(IO_L12P_T1_MRCC_14) P15(IO_L11P_T1_SRCC_14) P16(IO_L11N_T1_SRCC_14) P18(IO_L10N_T1_D15_14) R1(IO_L13N_T2_MRCC_34) R2(IO_L13P_T2_MRCC_34) R3(IO_L14P_T2_SRCC_34) R5(IO_L21P_T3_DQS_34) R6(IO_25_34) R7(IO_L22P_T3_34) R13(IO_L19P_T3_A10_D26_14) R15(IO_L12N_T1_MRCC_14) R16(IO_L14P_T2_SRCC_14) R17(IO_L14N_T2_SRCC_14) T2(IO_L14N_T2_SRCC_34) T3(IO_L17N_T2_34) T4(IO_L17P_T2_34) T5(IO_L21N_T3_DQS_34) T7(IO_L22N_T3_34) T13(IO_L19N_T3_A09_D25_VREF_14) U1(IO_L15N_T2_DQS_34) U2(IO_L15P_T2_DQS_34) U4(IO_L18P_T2_34) U5(IO_L20N_T3_34) U6(IO_L20P_T3_34) U7(IO_L23P_T3_34) U10(IO_25_14) V2(IO_L16N_T2_34) V3(IO_L16P_T2_34) V4(IO_L18N_T2_34) V6(IO_L23N_T3_34) V7(IO_L24N_T3_34) V8(IO_L24P_T3_34)

### Buses and harness runs
bus ATTEN_[4..1] = port ATTEN_[4..1]
bus DC_CPL_[4..1] = port DC_CPL_[4..1]
bus PGA_CSn_[4..1] = port PGA_CSn_[4..1]
bus TERM_[4..1] = port TERM_[4..1]

### Notes on the sheet
- D3B Inversion!
- D4B Inversion!
- D4A Inversion!
- D2B Inversion!
- D2A Inversion!
- (in symbol IC FPGA XC7A50T-2CSG325C, part A) BANK 14
- (in symbol IC FPGA XC7A50T-2CSG325C, part B) BANK 15
- (in symbol IC FPGA XC7A50T-2CSG325C, part C) BANK 34

### Library data of the parts
C1000 C1028 = CAP 100nF 16V X7R 0402: as C1 on sheet Main; Package: 0402; Supplier 1: Mouser; Supplier Part Number 1: 81-GCM155R71C104KA5D; Value: 100nF
R1012 = RES 100 OHM 1% 1/10W 0402: Manufacturer: Yageo; Manufacturer Part Number: RC0402FR-07100RL; Tolerance: 1%; Package: 0402; Value: 100; Supplier 1: Mouser; Supplier Part Number 1: 603-RC0402FR-07100RL
U1000 = IC FPGA XC7A50T-2CSG325C: Artix-7 FPGA, 150 User I/Os, 4 GTP, 324-Ball BGA, Speed Grade 2, Commercial Grade, Pb-Free; Manufacturer: Xilinx; House Part Number: XC7A50T-2CSG325C; Manufacturer Part Number: XC7A50T-2CSG325C; Supplier 1: Digi-Key; Supplier Part Number 1: 122-2193-ND
U1003 = IC FLASH MX25U6432FZNI02: Manufacturer: Macronix; Supplier 1: Digi-Key; Supplier Part Number 1: 1092-MX25U6432FZNI02-ND; House Part Number: MX25U6432FZNI02; Manufacturer Part Number: MX25U6432FZNI02
Y1000 = OSC 25MHz ECS-TXO-2016: House Part Number: ECS-TXO-2016-33-250-TR; Manufacturer: ECS International; Supplier 1: Mouser; Supplier Part Number 1: 520-TXO-2016-33-250T; Manufacturer Part Number: ECS-TXO-2016-33-250-TR

## Sheet FPGA_MGT.SchDoc: ThunderScope 1000E
size A4; SheetNumber: 10; SheetTotal: 14
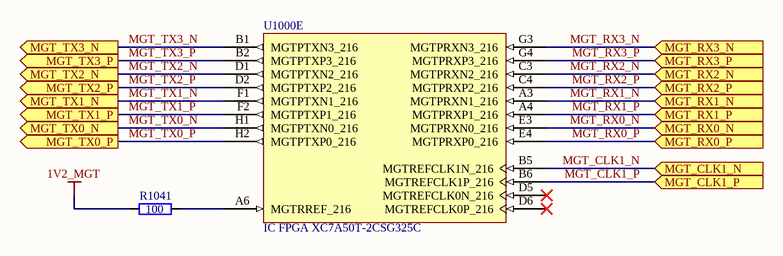
[diagram p4: FPGA_MGT.SchDoc]

### Parts
R1041  100  [GEN_R_0402]
U1000  IC FPGA XC7A50T-2CSG325C  [XILINX_XC7A50T-2CSG325C]  (part E of 9)

### Ports
MGT_CLK1_N (in), MGT_CLK1_P (in), MGT_RX0_N (in), MGT_RX0_P (in), MGT_RX1_N (in), MGT_RX1_P (in), MGT_RX2_N (in), MGT_RX2_P (in), MGT_RX3_N (in), MGT_RX3_P (in), MGT_TX0_N (out), MGT_TX0_P (out), MGT_TX1_N (out), MGT_TX1_P (out), MGT_TX2_N (out), MGT_TX2_P (out), MGT_TX3_N (out), MGT_TX3_P (out)

### Nets
1V2_MGT: R1041.1
MGT_CLK1_N: U1000.B5(MGTREFCLK1N_216) ; port MGT_CLK1_N
MGT_CLK1_P: U1000.B6(MGTREFCLK1P_216) ; port MGT_CLK1_P
MGT_RX0_N: U1000.E3(MGTPRXN0_216) ; port MGT_RX0_N
MGT_RX0_P: U1000.E4(MGTPRXP0_216) ; port MGT_RX0_P
MGT_RX1_N: U1000.A3(MGTPRXN1_216) ; port MGT_RX1_N
MGT_RX1_P: U1000.A4(MGTPRXP1_216) ; port MGT_RX1_P
MGT_RX2_N: U1000.C3(MGTPRXN2_216) ; port MGT_RX2_N
MGT_RX2_P: U1000.C4(MGTPRXP2_216) ; port MGT_RX2_P
MGT_RX3_N: U1000.G3(MGTPRXN3_216) ; port MGT_RX3_N
MGT_RX3_P: U1000.G4(MGTPRXP3_216) ; port MGT_RX3_P
MGT_TX0_N: U1000.H1(MGTPTXN0_216) ; port MGT_TX0_N
MGT_TX0_P: U1000.H2(MGTPTXP0_216) ; port MGT_TX0_P
MGT_TX1_N: U1000.F1(MGTPTXN1_216) ; port MGT_TX1_N
MGT_TX1_P: U1000.F2(MGTPTXP1_216) ; port MGT_TX1_P
MGT_TX2_N: U1000.D1(MGTPTXN2_216) ; port MGT_TX2_N
MGT_TX2_P: U1000.D2(MGTPTXP2_216) ; port MGT_TX2_P
MGT_TX3_N: U1000.B1(MGTPTXN3_216) ; port MGT_TX3_N
MGT_TX3_P: U1000.B2(MGTPTXP3_216) ; port MGT_TX3_P
NetR1041_2: R1041.2 U1000.A6(MGTRREF_216)

Not connected (* = marked no-connect by the designer): U1000 D5(MGTREFCLK0N_216)* D6(MGTREFCLK0P_216)*

### Library data of the parts
R1041 = RES 100 OHM 1% 1/10W 0402: as R1012 on sheet FPGA_Bank_IO; Package: 0402; Value: 100; Supplier 1: Mouser; Supplier Part Number 1: 603-RC0402FR-07100RL
U1000 = IC FPGA XC7A50T-2CSG325C: as U1000 on sheet FPGA_Bank_IO; House Part Number: XC7A50T-2CSG325C; Manufacturer Part Number: XC7A50T-2CSG325C; Supplier 1: Digi-Key; Supplier Part Number 1: 122-2193-ND

## Sheet FPGA_CFG.SchDoc: ThunderScope 1000E
size A4; SheetNumber: 9; SheetTotal: 14
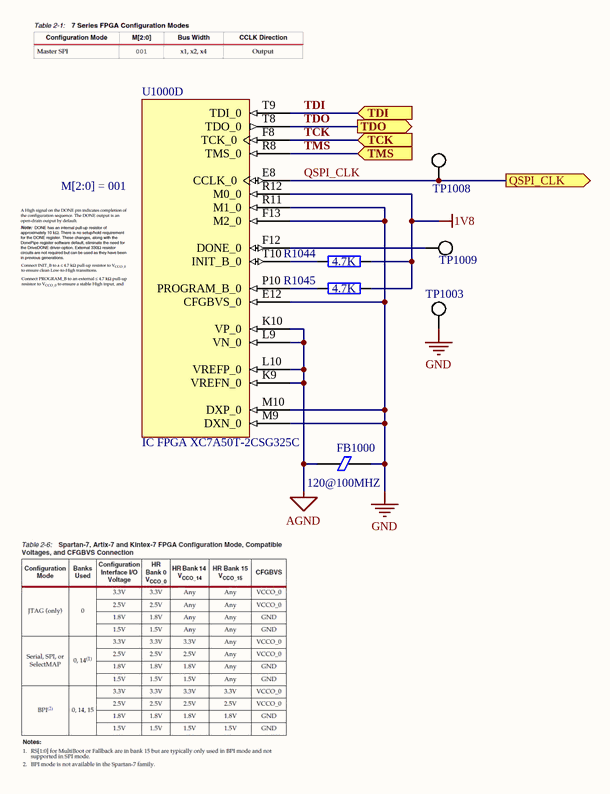
[diagram p5: FPGA_CFG.SchDoc]

### Parts
FB1000  120@100MHZ  [GEN_R_0402]
R1044  4.7K  [GEN_R_0201]
R1045  4.7K  [GEN_R_0201]
TP1003  PCB  [GEN_TP_PCB]  (value not drawn)  (no BOM)
TP1008  PCB  [GEN_TP_PCB]  (value not drawn)  (no BOM)
TP1009  PCB  [GEN_TP_PCB]  (value not drawn)  (no BOM)
U1000  IC FPGA XC7A50T-2CSG325C  [XILINX_XC7A50T-2CSG325C]  (part D of 9)

### Ports
QSPI_CLK (out), TCK (in), TDI (in), TDO (out), TMS (in)

### Nets
1V8: R1044.2 R1045.2 U1000.R12(M0_0)
AGND: FB1000.1 U1000.K9(VREFN_0) U1000.K10(VP_0) U1000.L9(VN_0) U1000.L10(VREFP_0)
GND: FB1000.2 TP1003.1 U1000.E12(CFGBVS_0) U1000.F13(M2_0) U1000.M9(DXN_0) U1000.M10(DXP_0) U1000.R11(M1_0)
QSPI_CLK: TP1008.1 U1000.E8(CCLK_0) ; port QSPI_CLK
TCK: U1000.F8(TCK_0) ; port TCK
TDI: U1000.T9(TDI_0) ; port TDI
TDO: U1000.T8(TDO_0) ; port TDO
TMS: U1000.R8(TMS_0) ; port TMS
NetR1044_1: R1044.1 U1000.T10(INIT_B_0)
NetR1045_1: R1045.1 U1000.P10(PROGRAM_B_0)
NetTP1009_1: TP1009.1 U1000.F12(DONE_0)

### Notes on the sheet
- M[2:0] = 001

### Library data of the parts
FB1000 = FERRITE BEAD 120 OHM 0402: House Part Number: BLM15PX121SN1D; Manufacturer: Murata; Supplier 1: Mouser; Supplier Part Number 1: 81-BLM15PX121SN1D; Manufacturer Part Number: BLM15PX121SN1D
R1044 R1045 = RES 4.7K OHM 1% 1/20W 0201: House Part Number: R-4.7K-0201-1%-001; Manufacturer: Yageo; Manufacturer Part Number: RC0201FR-074K7L; Tolerance: 1%; Package: 0201; Supplier 1: Mouser; Supplier Part Number 1: 603-RC0201FR-074K7L; Value: 4.7K
TP1003 TP1008 TP1009 = TP PCB 1mm
U1000 = IC FPGA XC7A50T-2CSG325C: as U1000 on sheet FPGA_Bank_IO; House Part Number: XC7A50T-2CSG325C; Manufacturer Part Number: XC7A50T-2CSG325C; Supplier 1: Digi-Key; Supplier Part Number 1: 122-2193-ND

## Sheet FPGA_PWR.SchDoc: ThunderScope 1000E
size A4; SheetNumber: 11; SheetTotal: 14
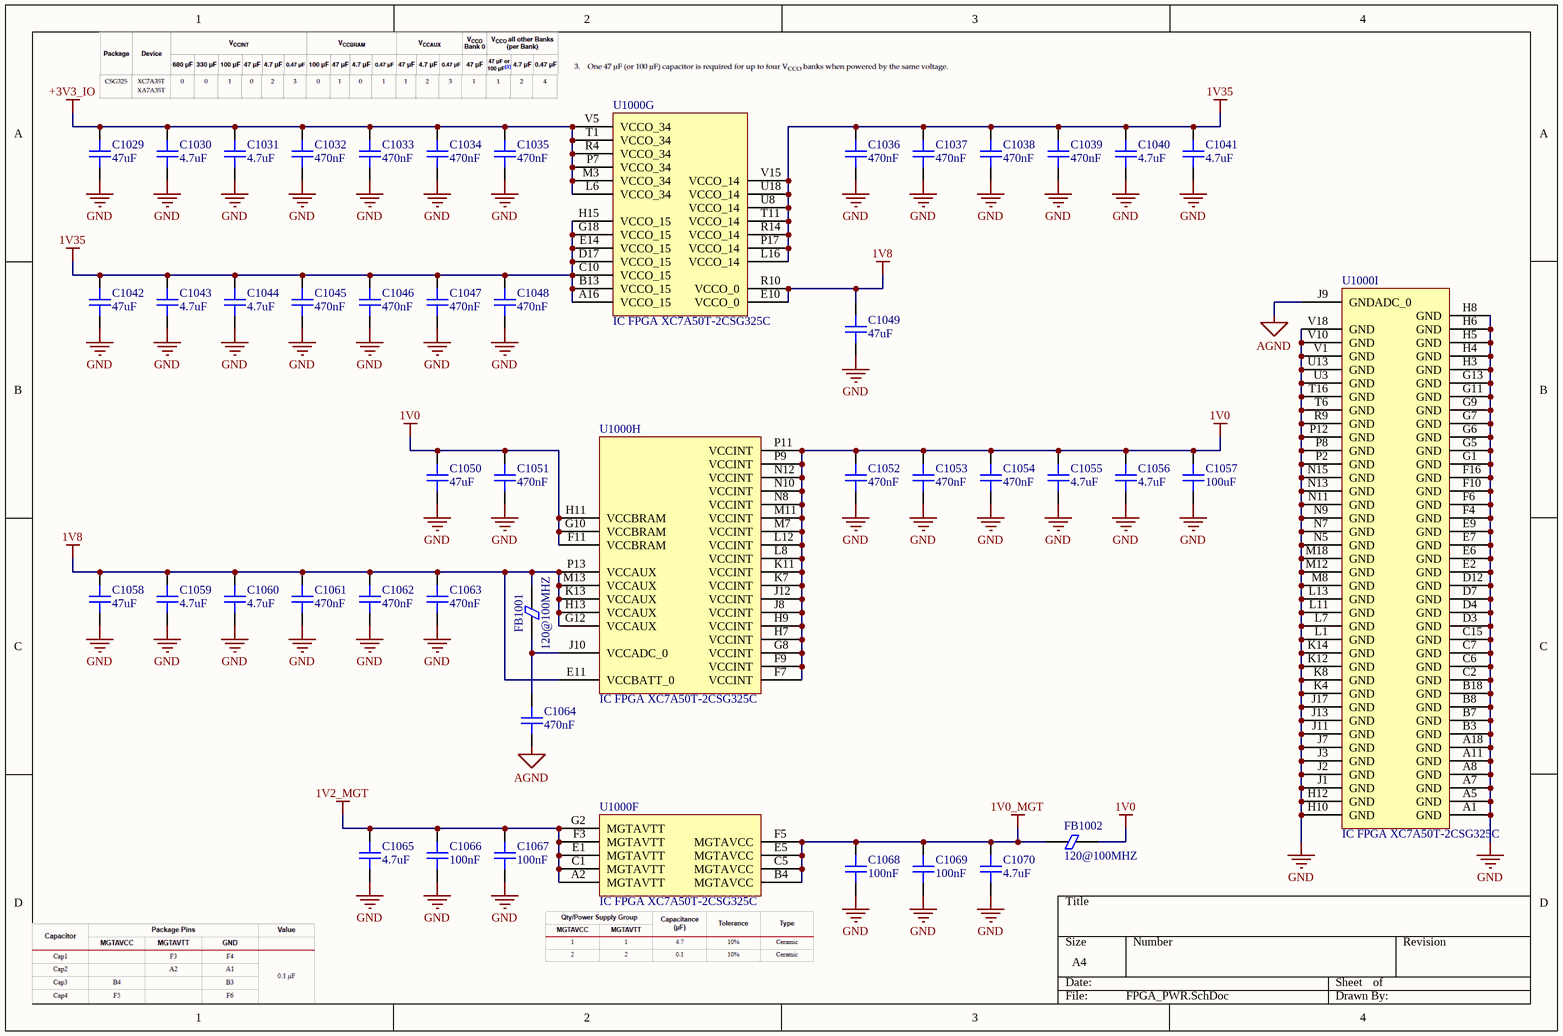
[diagram p6: FPGA_PWR.SchDoc]

### Parts
C1029  47uF  [GEN_C_0805]
C1030  4.7uF  [GEN_C_0402]
C1031  4.7uF  [GEN_C_0402]
C1032  470nF  [GEN_C_0201]
C1033  470nF  [GEN_C_0201]
C1034  470nF  [GEN_C_0201]
C1035  470nF  [GEN_C_0201]
C1036  470nF  [GEN_C_0201]
C1037  470nF  [GEN_C_0201]
C1038  470nF  [GEN_C_0201]
C1039  470nF  [GEN_C_0201]
C1040  4.7uF  [GEN_C_0402]
C1041  4.7uF  [GEN_C_0402]
C1042  47uF  [GEN_C_0805]
C1043  4.7uF  [GEN_C_0402]
C1044  4.7uF  [GEN_C_0402]
C1045  470nF  [GEN_C_0201]
C1046  470nF  [GEN_C_0201]
C1047  470nF  [GEN_C_0201]
C1048  470nF  [GEN_C_0201]
C1049  47uF  [GEN_C_0805]
C1050  47uF  [GEN_C_0805]
C1051  470nF  [GEN_C_0201]
C1052  470nF  [GEN_C_0201]
C1053  470nF  [GEN_C_0201]
C1054  470nF  [GEN_C_0201]
C1055  4.7uF  [GEN_C_0402]
C1056  4.7uF  [GEN_C_0402]
C1057  100uF  [GEN_C_1210]
C1058  47uF  [GEN_C_0805]
C1059  4.7uF  [GEN_C_0402]
C1060  4.7uF  [GEN_C_0402]
C1061  470nF  [GEN_C_0201]
C1062  470nF  [GEN_C_0201]
C1063  470nF  [GEN_C_0201]
C1064  470nF  [GEN_C_0201]
C1065  4.7uF  [GEN_C_0402]
C1066  100nF  [GEN_C_0201]
C1067  100nF  [GEN_C_0201]
C1068  100nF  [GEN_C_0201]
C1069  100nF  [GEN_C_0201]
C1070  4.7uF  [GEN_C_0402]
FB1001  120@100MHZ  [GEN_R_0402]
FB1002  120@100MHZ  [GEN_R_0402]
U1000  IC FPGA XC7A50T-2CSG325C  [XILINX_XC7A50T-2CSG325C]  (parts F,G,H,I of 9)

### Nets
1V0: C1050.2 C1051.2 C1052.2 C1053.2 C1054.2 C1055.2 C1056.2 C1057.2 FB1002.1 U1000.F7(VCCINT) U1000.F9(VCCINT) U1000.F11(VCCBRAM) U1000.G8(VCCINT) U1000.G10(VCCBRAM) U1000.H7(VCCINT) U1000.H9(VCCINT) U1000.H11(VCCBRAM) U1000.J8(VCCINT) U1000.J12(VCCINT) U1000.K7(VCCINT) U1000.K11(VCCINT) U1000.L8(VCCINT) U1000.L12(VCCINT) U1000.M7(VCCINT) U1000.M11(VCCINT) U1000.N8(VCCINT) U1000.N10(VCCINT) U1000.N12(VCCINT) U1000.P9(VCCINT) U1000.P11(VCCINT)
1V0_MGT: C1068.2 C1069.2 C1070.2 FB1002.2 U1000.B4(MGTAVCC) U1000.C5(MGTAVCC) U1000.E5(MGTAVCC) U1000.F5(MGTAVCC)
1V2_MGT: C1065.2 C1066.2 C1067.2 U1000.A2(MGTAVTT) U1000.C1(MGTAVTT) U1000.E1(MGTAVTT) U1000.F3(MGTAVTT) U1000.G2(MGTAVTT)
1V8: C1049.2 C1058.2 C1059.2 C1060.2 C1061.2 C1062.2 C1063.2 FB1001.2 U1000.E10(VCCO_0) U1000.E11(VCCBATT_0) U1000.G12(VCCAUX) U1000.H13(VCCAUX) U1000.K13(VCCAUX) U1000.M13(VCCAUX) U1000.P13(VCCAUX) U1000.R10(VCCO_0)
1V35: C1036.2 C1037.2 C1038.2 C1039.2 C1040.2 C1041.2 C1042.2 C1043.2 C1044.2 C1045.2 C1046.2 C1047.2 C1048.2 U1000.A16(VCCO_15) U1000.B13(VCCO_15) U1000.C10(VCCO_15) U1000.D17(VCCO_15) U1000.E14(VCCO_15) U1000.G18(VCCO_15) U1000.H15(VCCO_15) U1000.L16(VCCO_14) U1000.P17(VCCO_14) U1000.R14(VCCO_14) U1000.T11(VCCO_14) U1000.U8(VCCO_14) U1000.U18(VCCO_14) U1000.V15(VCCO_14)
+3V3_IO: C1029.2 C1030.2 C1031.2 C1032.2 C1033.2 C1034.2 C1035.2 U1000.L6(VCCO_34) U1000.M3(VCCO_34) U1000.P7(VCCO_34) U1000.R4(VCCO_34) U1000.T1(VCCO_34) U1000.V5(VCCO_34)
AGND: C1064.1 U1000.J9(GNDADC_0)
GND: C1029.1 C1030.1 C1031.1 C1032.1 C1033.1 C1034.1 C1035.1 C1036.1 C1037.1 C1038.1 C1039.1 C1040.1 C1041.1 C1042.1 C1043.1 C1044.1 C1045.1 C1046.1 C1047.1 C1048.1 C1049.1 C1050.1 C1051.1 C1052.1 C1053.1 C1054.1 C1055.1 C1056.1 C1057.1 C1058.1 C1059.1 C1060.1 C1061.1 C1062.1 C1063.1 C1065.1 C1066.1 C1067.1 C1068.1 C1069.1 C1070.1 U1000.A1(GND) U1000.A5(GND) U1000.A7(GND) U1000.A8(GND) U1000.A11(GND) U1000.A18(GND) U1000.B3(GND) U1000.B7(GND) U1000.B8(GND) U1000.B18(GND) U1000.C2(GND) U1000.C6(GND) U1000.C7(GND) U1000.C15(GND) U1000.D3(GND) U1000.D4(GND) U1000.D7(GND) U1000.D12(GND) U1000.E2(GND) U1000.E6(GND) U1000.E7(GND) U1000.E9(GND) U1000.F4(GND) U1000.F6(GND) U1000.F10(GND) U1000.F16(GND) U1000.G1(GND) U1000.G5(GND) U1000.G6(GND) U1000.G7(GND) U1000.G9(GND) U1000.G11(GND) U1000.G13(GND) U1000.H3(GND) U1000.H4(GND) U1000.H5(GND) U1000.H6(GND) U1000.H8(GND) U1000.H10(GND) U1000.H12(GND) U1000.J1(GND) U1000.J2(GND) U1000.J3(GND) U1000.J7(GND) U1000.J11(GND) U1000.J13(GND) U1000.J17(GND) U1000.K4(GND) U1000.K8(GND) U1000.K12(GND) U1000.K14(GND) U1000.L1(GND) U1000.L7(GND) U1000.L11(GND) U1000.L13(GND) U1000.M8(GND) U1000.M12(GND) U1000.M18(GND) U1000.N5(GND) U1000.N7(GND) U1000.N9(GND) U1000.N11(GND) U1000.N13(GND) U1000.N15(GND) U1000.P2(GND) U1000.P8(GND) U1000.P12(GND) U1000.R9(GND) U1000.T6(GND) U1000.T16(GND) U1000.U3(GND) U1000.U13(GND) U1000.V1(GND) U1000.V10(GND) U1000.V18(GND)
NetC1064_2: C1064.2 FB1001.1 U1000.J10(VCCADC_0)

### Library data of the parts
C1029 C1042 C1049 C1050 C1058 = CAP 47uF 6.3V X5R 0805: House Part Number: C-47uF-0805-002; Manufacturer: Samsung; Manufacturer Part Number: CL21A476MQYNNNE; Voltage Rating: 6.3V; Package: 0805; Value: 47uF; Supplier 1: Mouser; Supplier Part Number 1: 187-CL32A226KPJNNNE
C1030 C1031 C1040 C1041 C1043 C1044 C1055 C1056 C1059 C1060 C1065 C1070 = CAP 4.7uF 6.3V X5R 0402: House Part Number: C-4.7uF-0402-002; Manufacturer: Murata; Manufacturer Part Number: GRM155R60J475ME47D; Voltage Rating: 6.3V; Package: 0402; Value: 4.7uF; Supplier 1: Mouser; Supplier Part Number 1: 81-GRM155R60J475ME7D
C1032-C1039 C1045-C1048 C1051-C1054 C1061-C1064 = CAP 470nF 6.3V X5R 0201: House Part Number: C-470nF-0201-002; Manufacturer: Murata; Manufacturer Part Number: GRM033R60J474KE90D; Voltage Rating: 6.3V; Package: 0201; Value: 470nF; Supplier 1: Mouser; Supplier Part Number 1: 81-GRM33R60J474KE90D
C1057 = CAP 100uF 6.3V X5R 1210: House Part Number: C-100uF-1210-002; Manufacturer: Samsung; Manufacturer Part Number: CL32A107MQVNNNE; Voltage Rating: 6.3V; Package: 1210; Value: 100uF; Supplier 1: Mouser; Supplier Part Number 1: 187-CL32A107MQVNNNE
C1066-C1069 = CAP 100nF 6.3V X5R 0201: as C15 on sheet FPGA; Package: 0201; Supplier 1: Mouser; Supplier Part Number 1: 81-GRM033R60J104KE19; Value: 100nF
FB1001 FB1002 = FERRITE BEAD 120 OHM 0402: as FB1000 on sheet FPGA_CFG; Supplier 1: Mouser; Supplier Part Number 1: 81-BLM15PX121SN1D; Manufacturer Part Number: BLM15PX121SN1D
U1000 = IC FPGA XC7A50T-2CSG325C: as U1000 on sheet FPGA_Bank_IO; House Part Number: XC7A50T-2CSG325C; Manufacturer Part Number: XC7A50T-2CSG325C; Supplier 1: Digi-Key; Supplier Part Number 1: 122-2193-ND

## Sheet FPGA_REG.SchDoc: ThunderScope 1000E
size A4; SheetNumber: 12; SheetTotal: 14
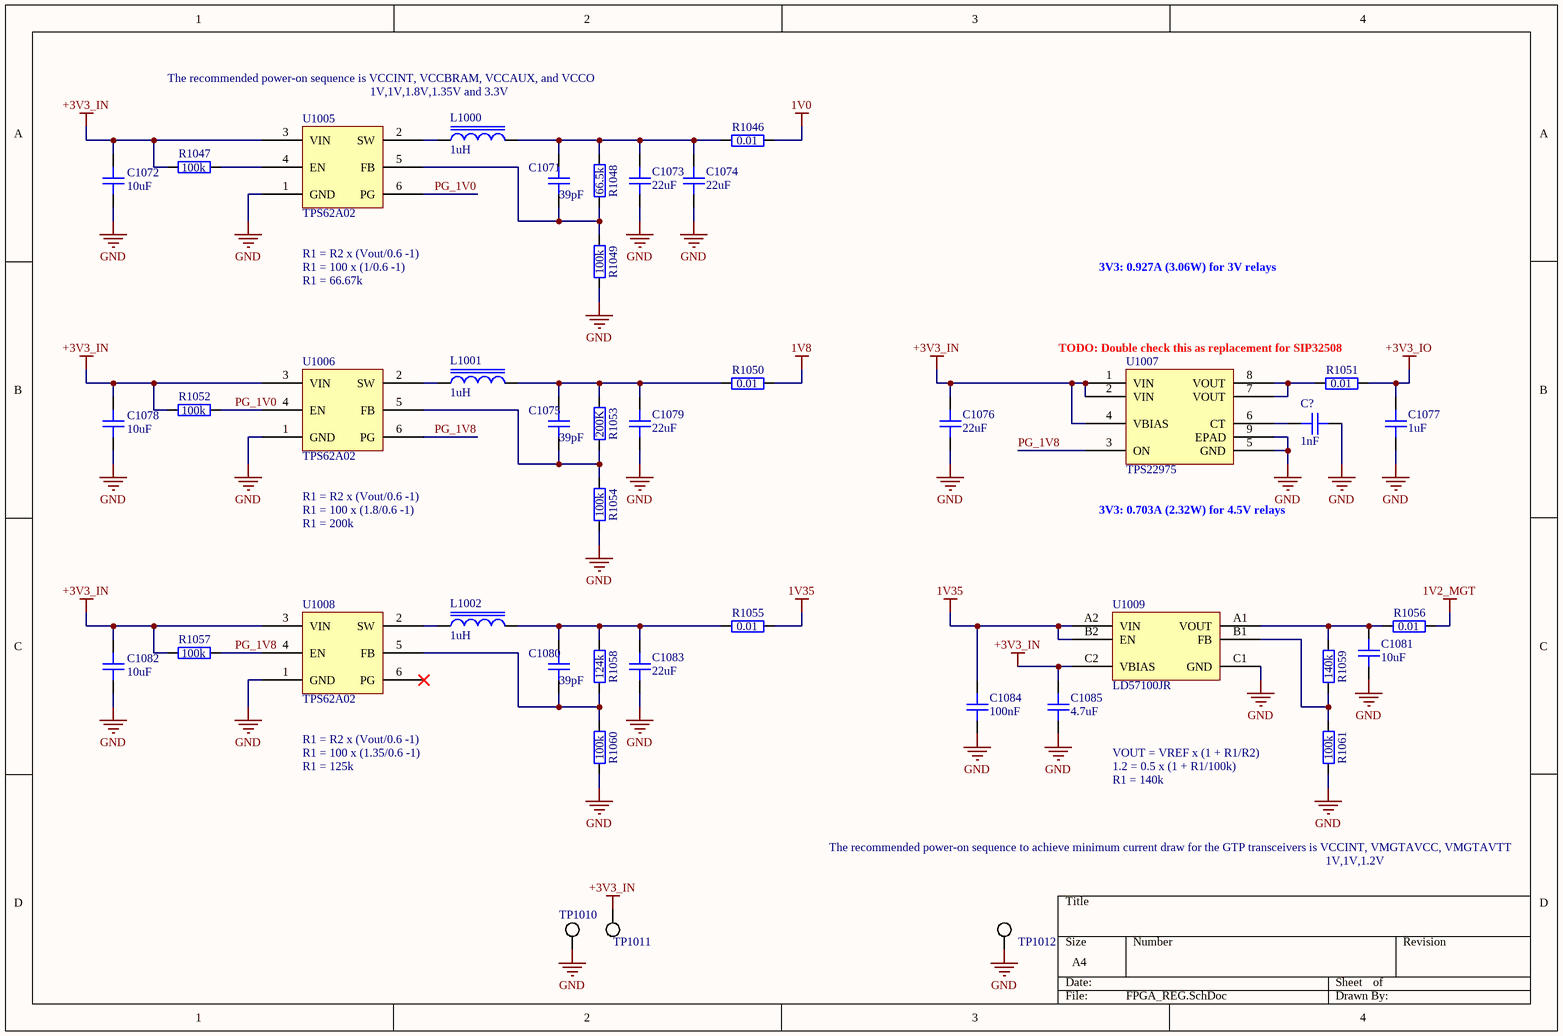
[diagram p7: FPGA_REG.SchDoc]

### Parts
C1071  39pF  [GEN_C_0402]
C1072  10uF  [GEN_C_0603]
C1073  22uF  [GEN_C_0805]
C1074  22uF  [GEN_C_0805]
C1075  39pF  [GEN_C_0402]
C1076  22uF  [GEN_C_0805]
C1077  1uF  [GEN_C_0402]
C1078  10uF  [GEN_C_0603]
C1079  22uF  [GEN_C_0805]
C1080  39pF  [GEN_C_0402]
C1081  10uF  [GEN_C_0603]
C1082  10uF  [GEN_C_0603]
C1083  22uF  [GEN_C_0805]
C1084  100nF  [GEN_C_0402]
C1085  4.7uF  [GEN_C_0402]
C?  1nF  [GEN_C_0402]
L1000  1uH  [GEN_L_1210]
L1001  1uH  [GEN_L_1210]
L1002  1uH  [GEN_L_1210]
R1046  0.01  [GEN_R_0603]
R1047  100k  [GEN_R_0402]
R1048  66.5k  [GEN_R_0402]
R1049  100k  [GEN_R_0402]
R1050  0.01  [GEN_R_0603]
R1051  0.01  [GEN_R_0603]
R1052  100k  [GEN_R_0402]
R1053  200K  [GEN_R_0402]
R1054  100k  [GEN_R_0402]
R1055  0.01  [GEN_R_0603]
R1056  0.01  [GEN_R_0603]
R1057  100k  [GEN_R_0402]
R1058  124k  [GEN_R_0402]
R1059  140k  [GEN_R_0402]
R1060  100k  [GEN_R_0402]
R1061  100k  [GEN_R_0402]
TP1010  PCB  [GEN_TP_PCB]  (value not drawn)  (no BOM)
TP1011  PCB  [GEN_TP_PCB]  (value not drawn)  (no BOM)
TP1012  PCB  [GEN_TP_PCB]  (value not drawn)  (no BOM)
U1005  TPS62A02  [TI_SOT563_DRL0006A]
U1006  TPS62A02  [TI_SOT563_DRL0006A]
U1007  TPS22975  [TI_WSON8_DSG0008A]
U1008  TPS62A02  [TI_SOT563_DRL0006A]
U1009  LD57100JR  [ST_FlipChip6]

### Nets
1V0: R1046.2
1V2_MGT: R1056.2
1V8: R1050.2
1V35: C1084.2 R1055.2 U1009.A2(VIN) U1009.B2(EN)
+3V3_IN: C1072.2 C1076.2 C1078.2 C1082.2 C1085.2 R1047.2 R1052.2 R1057.2 TP1011.1 U1005.3(VIN) U1006.3(VIN) U1007.1(VIN) U1007.2(VIN) U1007.4(VBIAS) U1008.3(VIN) U1009.C2(VBIAS)
+3V3_IO: C1077.2 R1051.2
GND: C1072.1 C1073.1 C1074.1 C1076.1 C1077.1 C1078.1 C1079.1 C1081.1 C1082.1 C1083.1 C1084.1 C1085.1 C?.1 R1049.1 R1054.1 R1060.1 R1061.1 TP1010.1 TP1012.1 U1005.1(GND) U1006.1(GND) U1007.5(GND) U1007.9(EPAD) U1008.1(GND) U1009.C1(GND)
PG_1V0: R1052.1 U1005.6(PG) U1006.4(EN)
PG_1V8: R1057.1 U1006.6(PG) U1007.3(ON) U1008.4(EN)
NetC1071_1: C1071.1 R1048.1 R1049.2 U1005.5(FB)
NetC1071_2: C1071.2 C1073.2 C1074.2 L1000.2 R1046.1 R1048.2
NetC1075_1: C1075.1 R1053.1 R1054.2 U1006.5(FB)
NetC1075_2: C1075.2 C1079.2 L1001.2 R1050.1 R1053.2
NetC1080_1: C1080.1 R1058.1 R1060.2 U1008.5(FB)
NetC1080_2: C1080.2 C1083.2 L1002.2 R1055.1 R1058.2
NetC1081_2: C1081.2 R1056.1 R1059.2 U1009.A1(VOUT)
NetC?_2: C?.2 U1007.6(CT)
NetL1000_1: L1000.1 U1005.2(SW)
NetL1001_1: L1001.1 U1006.2(SW)
NetL1002_1: L1002.1 U1008.2(SW)
NetR1047_1: R1047.1 U1005.4(EN)
NetR1051_1: R1051.1 U1007.7(VOUT) U1007.8(VOUT)
NetR1059_1: R1059.1 R1061.2 U1009.B1(FB)

Not connected (* = marked no-connect by the designer): U1008 6(PG)*

### Notes on the sheet
- The recommended power-on sequence is VCCINT, VCCBRAM, VCCAUX, and VCCO
- 1V,1V,1.8V,1.35V and 3.3V
- R1 = R2 x (Vout/0.6 -1)
- R1 = 100 x (1/0.6 -1)
- R1 = 66.67k
- 3V3: 0.927A (3.06W) for 3V relays
- TODO: Double check this as replacement for SIP32508
- R1 = 100 x (1.8/0.6 -1)
- 3V3: 0.703A (2.32W) for 4.5V relays
- R1 = 200k
- R1 = 100 x (1.35/0.6 -1)
- R1 = 125k
- VOUT = VREF x (1 + R1/R2)
- 1.2 = 0.5 x (1 + R1/100k)
- R1 = 140k
- The recommended power-on sequence to achieve minimum current draw for the GTP transceivers is VCCINT, VMGTAVCC, VMGTAVTT
- 1V,1V,1.2V

### Library data of the parts
C1071 C1075 C1080 = CAP 39pF 50V C0G 0402: House Part Number: C-39pF-0402-002; Manufacturer: KEMET; Manufacturer Part Number: C0402C390J5GACTU; Temperature Coefficient: C0G; Voltage Rating: 50V; Package: 0402; Value: 39pF; Supplier 1: Mouser; Supplier Part Number 1: 80-C0402C390J5G
C1072 C1078 C1081 C1082 = CAP 10uF 10V X5R 0603: House Part Number: C-10uF-0603-002; Manufacturer: Murata; Manufacturer Part Number: GRM188R61A106ME69D; Voltage Rating: 10V; Package: 0402; Supplier 1: Mouser; Supplier Part Number 1: 81-GRM188R61A106ME9D; Value: 10uF
C1073 C1074 C1076 C1079 C1083 = CAP 22uF 25V X5R 0805: House Part Number: C-22uF-0805-002; Manufacturer: Murata; Manufacturer Part Number: GRM21BR61E226ME44L; Voltage Rating: 25V; Package: 0805; Value: 22uF; Supplier 1: Mouser; Supplier Part Number 1: 81-GRM21BR61E226ME4L
C1077 = CAP 1uF 25V X5R 0402: Manufacturer: Murata; Manufacturer Part Number: GRM155R61E105KA12D; Voltage Rating: 25V; Package: 0402; Value: 1uF; Supplier 1: Mouser; Supplier Part Number 1: 81-GRM155R61E105KA2D
C1084 = CAP 100nF 16V X7R 0402: as C1 on sheet Main; Package: 0402; Supplier 1: Mouser; Supplier Part Number 1: 81-GCM155R71C104KA5D; Value: 100nF
C1085 = CAP 4.7uF 6.3V X5R 0402: as C1030 on sheet FPGA_PWR; Package: 0402; Value: 4.7uF; Supplier 1: Mouser; Supplier Part Number 1: 81-GRM155R60J475ME7D
C? = CAP 1nF 50V C0G 0402: Manufacturer: Murata; Manufacturer Part Number: GRM1555C1H102FA01D; Voltage Rating: 50V; Package: 0402; Supplier 1: Mouser; Supplier Part Number 1: 81-GRM1555C1H102FA1D; Value: 1nF
L1000-L1002 = IND 1uH 5.5A 32 MOHM 1210: House Part Number: SRP3212-1R0M; Manufacturer: Bourns; Value: 1uH; Supplier 1: Mouser; Supplier Part Number 1: 652-SRP3212-1R0M; Manufacturer Part Number: SRP3212-1R0M
R1046 R1050 R1051 R1055 R1056 = RES 0.01 OHM 1% 1/4W 0603: House Part Number: R-0.01-0603-1%-001; Manufacturer: Susumu; Manufacturer Part Number: RL0816T-R010-F; Tolerance: 1%; Supplier 1: Mouser; Supplier Part Number 1: 754-RL0816T-R010-F; Value: 0.01; Package: 0603
R1047 R1049 R1052 R1054 R1057 R1060 R1061 = RES 100K OHM 1% 1/10W 0402: House Part Number: R-100K-0402-1%-001; Manufacturer: Yageo; Manufacturer Part Number: RC0402FR-07100KL; Tolerance: 1%; Package: 0402; Value: 100k; Supplier 1: Mouser; Supplier Part Number 1: 603-RC0402FR-07100KL
R1048 = RES 66.5K OHM 1% 1/16W 0402: House Part Number: R-66.5K-0402-1%-001; Manufacturer: Yageo; Manufacturer Part Number: RC0402FR-0766K5L; Tolerance: 1%; Package: 0402; Value: 66.5k; Supplier 1: Mouser; Supplier Part Number 1: 603-RC0402FR-0766K5L
R1053 = RES 200K OHM 1% 1/16W 0402: House Part Number: R-200K-0402-1%-001; Manufacturer: Yageo; Manufacturer Part Number: RC0402FR-07200KL; Tolerance: 1%; Package: 0402; Value: 200K; Supplier 1: Mouser; Supplier Part Number 1: 603-RC0402FR-07200KL
R1058 = RES 124K OHM 1% 1/10W 0402: House Part Number: R-124K-0402-1%-001; Manufacturer: Yageo; Manufacturer Part Number: RC0402FR-07124KL; Tolerance: 1%; Package: 0402; Value: 124k; Supplier 1: Mouser; Supplier Part Number 1: 603-RC0402FR-07124KL
R1059 = RES 140K OHM 1% 1/10W 0402: House Part Number: R-140K-0402-1%-001; Manufacturer: Yageo; Manufacturer Part Number: RC0402FR-07140KL; Tolerance: 1%; Package: 0402; Value: 140k; Supplier 1: Mouser; Supplier Part Number 1: 603-RC0402FR-07140KL
TP1010-TP1012 = TP PCB 1mm
U1005 U1006 U1008 = IC BUCK TPS62A02: House Part Number: TPS62A02DRLR; Manufacturer: Texas Instruments; Supplier 1: Texas Instruments; Supplier Part Number 1: TPS62A02DRLR; Manufacturer Part Number: TPS62A02DRLR
U1007 = IC SWITCH LOAD TPS22975: Manufacturer: Texas Instruments; Manufacturer Part Number: TPS22975DSGR; Supplier 1: Texas Instruments; Supplier Part Number 1: TPS22975DSGR
U1009 = IC LDO LD57100JR: Manufacturer: STMicroelectronics; Supplier 1: Mouser; Supplier Part Number 1: 511-LD57100JR; House Part Number: LD57100JR; Manufacturer Part Number: LD57100JR

## Sheet M2_KEY_M.SchDoc: ThunderScope 1000E
size A4; SheetNumber: 14; SheetTotal: 14
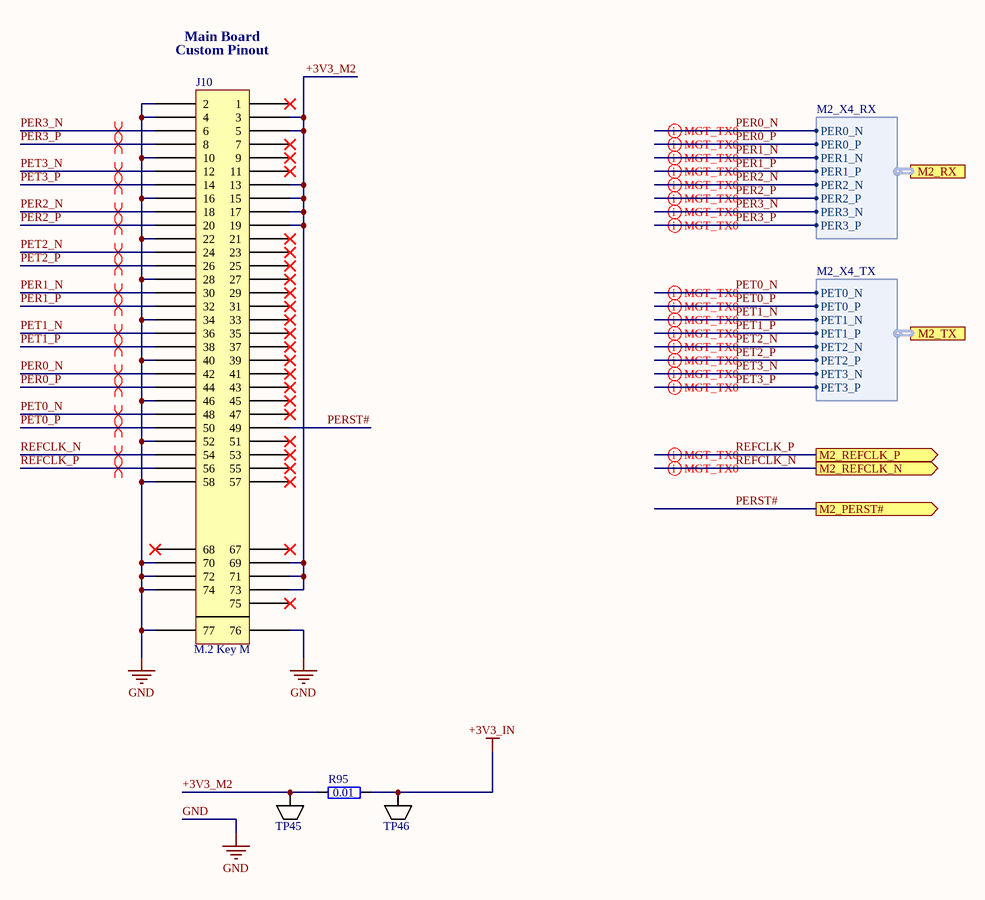
[diagram p8: M2_KEY_M.SchDoc]

### Parts
J10  M.2 Key M  [TE_M2_KEYM_2199230]
R95  0.01  [GEN_R_0603]
TP45  5015  [KEY_5015]  (value not drawn)
TP46  5015  [KEY_5015]  (value not drawn)

### Ports
M2_PERST# (out), M2_REFCLK_N (out), M2_REFCLK_P (out), M2_RX (harness M2_X4_RX), M2_TX (harness M2_X4_TX)

### Harnesses
M2_X4_RX: PER0_N, PER0_P, PER1_N, PER1_P, PER2_N, PER2_P, PER3_N, PER3_P
M2_X4_TX: PET0_N, PET0_P, PET1_N, PET1_P, PET2_N, PET2_P, PET3_N, PET3_P

### Nets
+3V3_IN: R95.2 TP46.1
GND: J10.2 J10.4 J10.10 J10.16 J10.22 J10.28 J10.34 J10.40 J10.46 J10.52 J10.58 J10.70 J10.72 J10.74 J10.76 J10.77
+3V3_M2: J10.3 J10.5 J10.13 J10.15 J10.17 J10.19 J10.69 J10.71 J10.73 R95.1 TP45.1
PER0_N: J10.42 ; port M2_RX.PER0_N  [project net M2_PER0_N]
PER0_P: J10.44 ; port M2_RX.PER0_P  [project net M2_PER0_P]
PER1_N: J10.30 ; port M2_RX.PER1_N  [project net M2_PER1_N]
PER1_P: J10.32 ; port M2_RX.PER1_P  [project net M2_PER1_P]
PER2_N: J10.18 ; port M2_RX.PER2_N  [project net M2_PER2_N]
PER2_P: J10.20 ; port M2_RX.PER2_P  [project net M2_PER2_P]
PER3_N: J10.6 ; port M2_RX.PER3_N  [project net M2_PER3_N]
PER3_P: J10.8 ; port M2_RX.PER3_P  [project net M2_PER3_P]
PERST#: J10.49 ; port M2_PERST#  [project net M2_PERST#]
PET0_N: J10.48 ; port M2_TX.PET0_N  [project net M2_PET0_N]
PET0_P: J10.50 ; port M2_TX.PET0_P  [project net M2_PET0_P]
PET1_N: J10.36 ; port M2_TX.PET1_N  [project net M2_PET1_N]
PET1_P: J10.38 ; port M2_TX.PET1_P  [project net M2_PET1_P]
PET2_N: J10.24 ; port M2_TX.PET2_N  [project net M2_PET2_N]
PET2_P: J10.26 ; port M2_TX.PET2_P  [project net M2_PET2_P]
PET3_N: J10.12 ; port M2_TX.PET3_N  [project net M2_PET3_N]
PET3_P: J10.14 ; port M2_TX.PET3_P  [project net M2_PET3_P]
REFCLK_N: J10.54 ; port M2_REFCLK_N  [project net M2_REFCLK_N]
REFCLK_P: J10.56 ; port M2_REFCLK_P  [project net M2_REFCLK_P]

Not connected (* = marked no-connect by the designer): J10 1* 7* 9* 11* 21* 23* 25* 27* 29* 31* 33* 35* 37* 39* 41* 43* 45* 47* 51* 53* 55* 57* 67* 68* 75*

### Layout directives
differential pair; differential pair class PCIe: M2_PER0_N, M2_PER0_P, M2_PER1_N, M2_PER1_P, M2_PER2_N, M2_PER2_P, M2_PER3_N, M2_PER3_P, M2_PET0_N, M2_PET0_P, M2_PET1_N, M2_PET1_P, M2_PET2_N, M2_PET2_P, M2_PET3_N, M2_PET3_P, M2_REFCLK_N, M2_REFCLK_P

### Notes on the sheet
- Main Board
- (near J10) Custom Pinout

### Library data of the parts
J10 = CONN M.2 Key M FEMALE: Manufacturer: TE Connectivity; Manufacturer Part Number: 1-2199230-5; Supplier 1: Mouser; Supplier Part Number 1: 571-1-2199230-5
R95 = RES 0.01 OHM 1% 1/4W 0603: as R1046 on sheet FPGA_REG; Supplier 1: Mouser; Supplier Part Number 1: 754-RL0816T-R010-F; Value: 0.01; Package: 0603
TP45 TP46 = TP KEYSTONE 5015: Manufacturer: Keystone Electronics; Supplier 1: Mouser; Supplier Part Number 1: 534-5015; Manufacturer Part Number: 5015